# Altium project SFPP.PrjPCB (part 1 of 2)
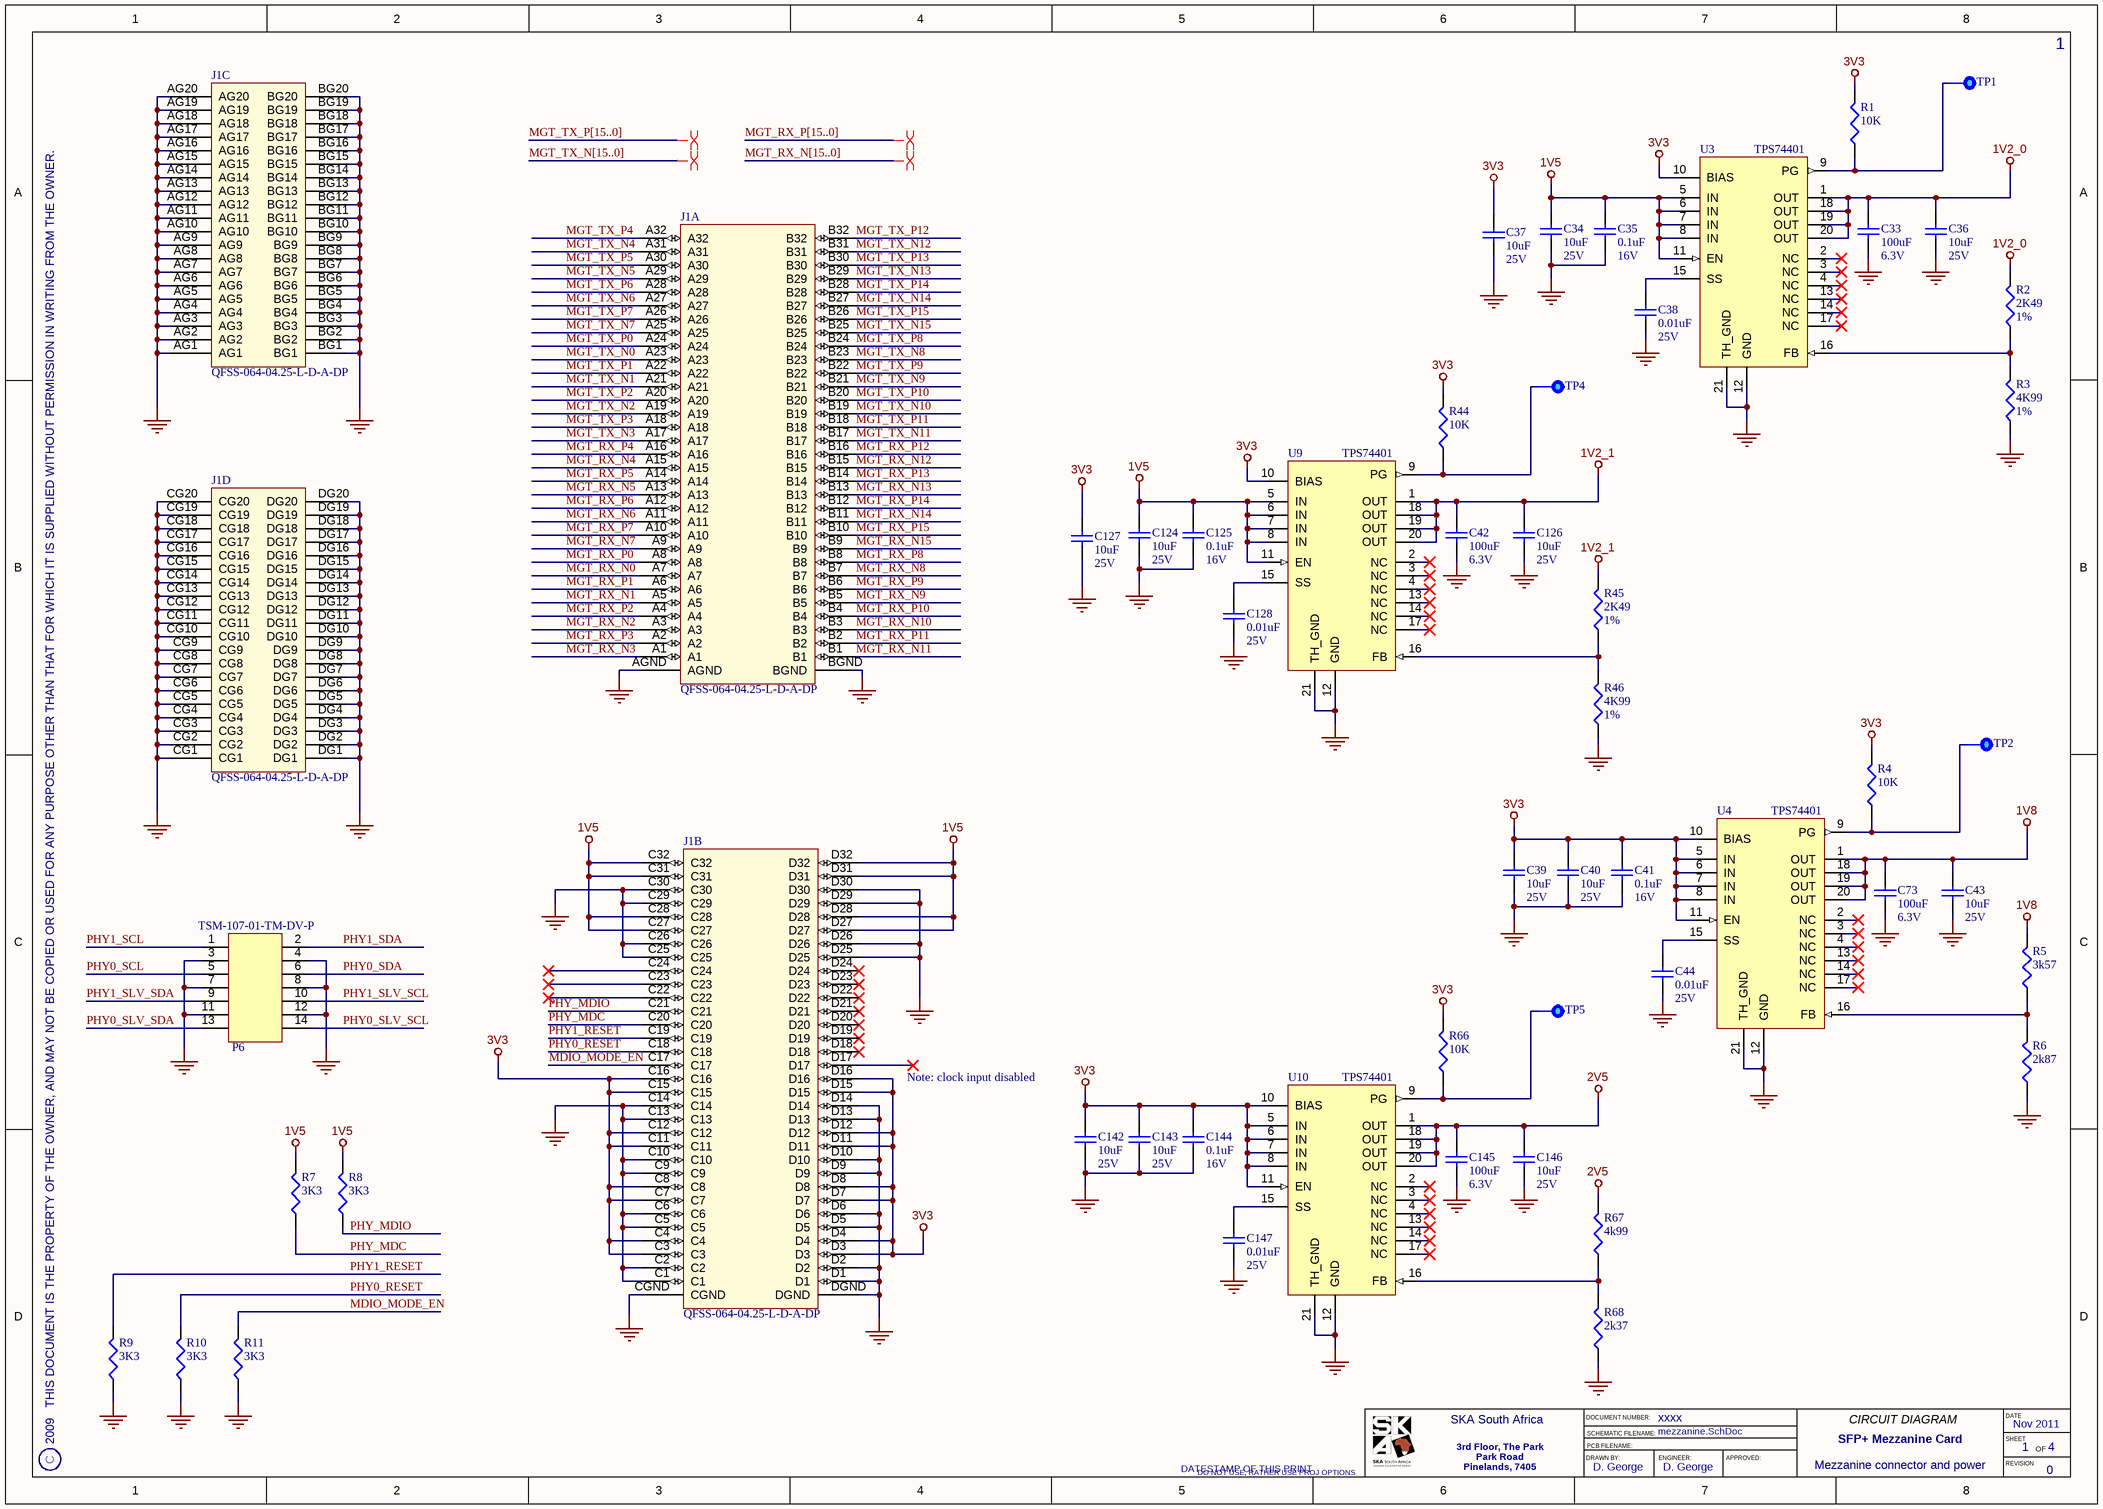
[diagram p0: mezzanine.SchDoc]
COMPANY_ADDRESS_1: 3rd Floor, The Park; COMPANY_ADDRESS_2: Park Road; COMPANY_ADDRESS_3: Pinelands, 7405; COMPANY_NAME1: SKA South Africa; COPYRIGHT_YEAR: 2011; PCB_REVISION: 0; PROJECT_TITLE: SFP+ Mezzanine Card; SCH_TITLE_DATE: Nov 2011; SCH_TITLE_DOCUMENTNUMBER: xxxx; SCH_TITLE_DRAWNBY: D. George; SCH_TITLE_ENGINEER: D. George
4 sheets, 259 parts. Net scope: global (net labels, ports and power ports of the same name join across sheets).
Board file: SFPP.PcbDoc
Sheets:
  mezzanine.SchDoc
  phy0.SchDoc
  phy1.SchDoc
  sfpp_conn.SchDoc

## Sheet mezzanine.SchDoc: Mezzanine connector and power
size A3; Date: DO NOT USE, RATHER USE PROJ OPTIONS; DrawnBy: DO NOT USE, RATHER USE PROJ OPTIONS; Engineer: DO NOT USE, RATHER USE PROJ OPTIONS; Organization: DO NOT USE, RATHER USE PROJ OPTIONS; DocumentNumber: DO NOT USE, RATHER USE PROJ OPTIONS; Revision: DO NOT USE, RATHER USE PROJ OPTIONS; SheetNumber: 1; SheetTotal: 4; SCH_Sheet_Filename: mezzanine.SchDoc; CurrentTime: DO NOT USE, RATHER USE PROJ OPTIONS; Time: DO NOT USE, RATHER USE PROJ OPTIONS; DocumentFullPathAndName: DO NOT USE, RATHER USE PROJ OPTIONS; DocumentName: DO NOT USE, RATHER USE PROJ OPTIONS; ModifiedDate: DO NOT USE, RATHER USE PROJ OPTIONS; ImagePath: DO NOT USE, RATHER USE PROJ OPTIONS

### Parts
C33  Rating: 6.3V  [CAPC3225X270L]  (hidden comment: 100uF)
C34  Rating: 25V  [CAPC3225X200L]  (hidden comment: 10uF)
C35  Rating: 16V  [CAPC1005X60L]  (hidden comment: 0.1uF)
C36  Rating: 25V  [CAPC3225X200L]  (hidden comment: 10uF)
C37  Rating: 25V  [CAPC3225X200L]  (hidden comment: 10uF)
C38  Rating: 25V  [CAPC1005X55L]  (hidden comment: 0.01uF)
C39  Rating: 25V  [CAPC3225X200L]  (hidden comment: 10uF)
C40  Rating: 25V  [CAPC3225X200L]  (hidden comment: 10uF)
C41  Rating: 16V  [CAPC1005X60L]  (hidden comment: 0.1uF)
C42  Rating: 6.3V  [CAPC3225X270L]  (hidden comment: 100uF)
C43  Rating: 25V  [CAPC3225X200L]  (hidden comment: 10uF)
C44  Rating: 25V  [CAPC1005X55L]  (hidden comment: 0.01uF)
C73  Rating: 6.3V  [CAPC3225X270L]  (hidden comment: 100uF)
C124  Rating: 25V  [CAPC3225X200L]  (hidden comment: 10uF)
C125  Rating: 16V  [CAPC1005X60L]  (hidden comment: 0.1uF)
C126  Rating: 25V  [CAPC3225X200L]  (hidden comment: 10uF)
C127  Rating: 25V  [CAPC3225X200L]  (hidden comment: 10uF)
C128  Rating: 25V  [CAPC1005X55L]  (hidden comment: 0.01uF)
C142  Rating: 25V  [CAPC3225X200L]  (hidden comment: 10uF)
C143  Rating: 25V  [CAPC3225X200L]  (hidden comment: 10uF)
C144  Rating: 16V  [CAPC1005X60L]  (hidden comment: 0.1uF)
C145  Rating: 6.3V  [CAPC3225X270L]  (hidden comment: 100uF)
C146  Rating: 25V  [CAPC3225X200L]  (hidden comment: 10uF)
C147  Rating: 25V  [CAPC1005X55L]  (hidden comment: 0.01uF)
J1  QFSS-064-04.25-L-D-A-DP  [SAMTEC_QFSS-064-04.25-L-D-DP-A]  (parts A,B,C,D of 4)
P6  TSM-107-01-TM-DV-P  [SAMTEC_TSM-107-01-TM-DV-P]
R1  10K  [RESC1005X40L]
R2  Tolerance: 1%  [RESC1005X40L]  (hidden comment: 2K49)
R3  Tolerance: 1%  [RESC1005X40L]  (hidden comment: 4K99)
R4  10K  [RESC1005X40L]
R5  3k57  [RESC1005X40L]
R6  2k87  [RESC1005X40L]
R7  3K3  [RESC1005X40L]
R8  3K3  [RESC1005X40L]
R9  3K3  [RESC1005X40L]
R10  3K3  [RESC1005X40L]
R11  3K3  [RESC1005X40L]
R44  10K  [RESC1005X40L]
R45  Tolerance: 1%  [RESC1005X40L]  (hidden comment: 2K49)
R46  Tolerance: 1%  [RESC1005X40L]  (hidden comment: 4K99)
R66  10K  [RESC1005X40L]
R67  value 4k99  [RESC1005X40L]  (hidden comment: 3k57)
R68  value 2k37  [RESC1005X40L]  (hidden comment: 2k87)
TP1  Testpoint  [TP100]  (value not drawn)  (no BOM)
TP2  Testpoint  [TP100]  (value not drawn)  (no BOM)
TP4  Testpoint  [TP100]  (value not drawn)  (no BOM)
TP5  Testpoint  [TP100]  (value not drawn)  (no BOM)
U3  TPS74401  [VQFN20]
U4  TPS74401  [VQFN20]
U9  TPS74401  [VQFN20]
U10  TPS74401  [VQFN20]

### Nets
1V2_0: C33.2 C36.2 R2.2 U3.1(OUT) U3.18(OUT) U3.19(OUT) U3.20(OUT)
1V2_1: C42.2 C126.2 R45.2 U9.1(OUT) U9.18(OUT) U9.19(OUT) U9.20(OUT)
1V5: C34.2 C35.2 C124.2 C125.2 J1.C27 J1.C28 J1.C31 J1.C32 J1.D27 J1.D28 J1.D31 J1.D32 R7.2 R8.2 U3.5(IN) U3.6(IN) U3.7(IN) U3.8(IN) U3.11(EN) U9.5(IN) U9.6(IN) U9.7(IN) U9.8(IN) U9.11(EN)
1V8: C43.2 C73.2 R5.2 U4.1(OUT) U4.18(OUT) U4.19(OUT) U4.20(OUT)
2V5: C145.2 C146.2 R67.2 U10.1(OUT) U10.18(OUT) U10.19(OUT) U10.20(OUT)
3V3: C37.2 C39.2 C40.2 C41.2 C127.2 C142.2 C143.2 C144.2 J1.C3 J1.C4 J1.C7 J1.C8 J1.C11 J1.C12 J1.C15 J1.C16 J1.D3 J1.D4 J1.D7 J1.D8 J1.D11 J1.D12 J1.D15 J1.D16 R1.2 R4.2 R44.2 R66.2 U3.10(BIAS) U4.5(IN) U4.6(IN) U4.7(IN) U4.8(IN) U4.10(BIAS) U4.11(EN) U9.10(BIAS) U10.5(IN) U10.6(IN) U10.7(IN) U10.8(IN) U10.10(BIAS) U10.11(EN)
GND: C33.1 C34.1 C35.1 C36.1 C37.1 C38.1 C39.1 C40.1 C41.1 C42.1 C43.1 C44.1 C73.1 C124.1 C125.1 C126.1 C127.1 C128.1 C142.1 C143.1 C144.1 C145.1 C146.1 C147.1 J1.AG1 J1.AG2 J1.AG3 J1.AG4 J1.AG5 J1.AG6 J1.AG7 J1.AG8 J1.AG9 J1.AG10 J1.AG11 J1.AG12 J1.AG13 J1.AG14 J1.AG15 J1.AG16 J1.AG17 J1.AG18 J1.AG19 J1.AG20 J1.AGND J1.BG1 J1.BG2 J1.BG3 J1.BG4 J1.BG5 J1.BG6 J1.BG7 J1.BG8 J1.BG9 J1.BG10 J1.BG11 J1.BG12 J1.BG13 J1.BG14 J1.BG15 J1.BG16 J1.BG17 J1.BG18 J1.BG19 J1.BG20 J1.BGND J1.C1 J1.C2 J1.C5 J1.C6 J1.C9 J1.C10 J1.C13 J1.C14 J1.C25 J1.C26 J1.C29 J1.C30 J1.CG1 J1.CG2 J1.CG3 J1.CG4 J1.CG5 J1.CG6 J1.CG7 J1.CG8 J1.CG9 J1.CG10 J1.CG11 J1.CG12 J1.CG13 J1.CG14 J1.CG15 J1.CG16 J1.CG17 J1.CG18 J1.CG19 J1.CG20 J1.CGND J1.D1 J1.D2 J1.D5 J1.D6 J1.D9 J1.D10 J1.D13 J1.D14 J1.D25 J1.D26 J1.D29 J1.D30 J1.DG1 J1.DG2 J1.DG3 J1.DG4 J1.DG5 J1.DG6 J1.DG7 J1.DG8 J1.DG9 J1.DG10 J1.DG11 J1.DG12 J1.DG13 J1.DG14 J1.DG15 J1.DG16 J1.DG17 J1.DG18 J1.DG19 J1.DG20 J1.DGND P6.3 P6.4 P6.7 P6.8 P6.11 P6.12 R3.1 R6.1 R9.1 R10.1 R11.1 R46.1 R68.1 U3.12(GND) U3.21(TH_GND) U4.12(GND) U4.21(TH_GND) U9.12(GND) U9.21(TH_GND) U10.12(GND) U10.21(TH_GND)
MDIO_MODE_EN: J1.C17 R11.2
MGT_RX_N0: J1.A7
MGT_RX_N1: J1.A5
MGT_RX_N2: J1.A3
MGT_RX_N3: J1.A1
MGT_RX_N4: J1.A15
MGT_RX_N5: J1.A13
MGT_RX_N6: J1.A11
MGT_RX_N7: J1.A9
MGT_RX_N8: J1.B7
MGT_RX_N9: J1.B5
MGT_RX_N10: J1.B3
MGT_RX_N11: J1.B1
MGT_RX_N12: J1.B15
MGT_RX_N13: J1.B13
MGT_RX_N14: J1.B11
MGT_RX_N15: J1.B9
MGT_RX_P0: J1.A8
MGT_RX_P1: J1.A6
MGT_RX_P2: J1.A4
MGT_RX_P3: J1.A2
MGT_RX_P4: J1.A16
MGT_RX_P5: J1.A14
MGT_RX_P6: J1.A12
MGT_RX_P7: J1.A10
MGT_RX_P8: J1.B8
MGT_RX_P9: J1.B6
MGT_RX_P10: J1.B4
MGT_RX_P11: J1.B2
MGT_RX_P12: J1.B16
MGT_RX_P13: J1.B14
MGT_RX_P14: J1.B12
MGT_RX_P15: J1.B10
MGT_TX_N0: J1.A23
MGT_TX_N1: J1.A21
MGT_TX_N2: J1.A19
MGT_TX_N3: J1.A17
MGT_TX_N4: J1.A31
MGT_TX_N5: J1.A29
MGT_TX_N6: J1.A27
MGT_TX_N7: J1.A25
MGT_TX_N8: J1.B23
MGT_TX_N9: J1.B21
MGT_TX_N10: J1.B19
MGT_TX_N11: J1.B17
MGT_TX_N12: J1.B31
MGT_TX_N13: J1.B29
MGT_TX_N14: J1.B27
MGT_TX_N15: J1.B25
MGT_TX_P0: J1.A24
MGT_TX_P1: J1.A22
MGT_TX_P2: J1.A20
MGT_TX_P3: J1.A18
MGT_TX_P4: J1.A32
MGT_TX_P5: J1.A30
MGT_TX_P6: J1.A28
MGT_TX_P7: J1.A26
MGT_TX_P8: J1.B24
MGT_TX_P9: J1.B22
MGT_TX_P10: J1.B20
MGT_TX_P11: J1.B18
MGT_TX_P12: J1.B32
MGT_TX_P13: J1.B30
MGT_TX_P14: J1.B28
MGT_TX_P15: J1.B26
PHY0_RESET: J1.C18 R10.2
PHY0_SCL: P6.5
PHY0_SDA: P6.6
PHY0_SLV_SCL: P6.14
PHY0_SLV_SDA: P6.13
PHY1_RESET: J1.C19 R9.2
PHY1_SCL: P6.1
PHY1_SDA: P6.2
PHY1_SLV_SCL: P6.10
PHY1_SLV_SDA: P6.9
PHY_MDC: J1.C20 R7.1
PHY_MDIO: J1.C21 R8.1
NetC38_2: C38.2 U3.15(SS)
NetC44_2: C44.2 U4.15(SS)
NetC128_2: C128.2 U9.15(SS)
NetC147_2: C147.2 U10.15(SS)
NetR1_1: R1.1 TP1.1 U3.9(PG)
NetR2_1: R2.1 R3.2 U3.16(FB)
NetR4_1: R4.1 TP2.1 U4.9(PG)
NetR5_1: R5.1 R6.2 U4.16(FB)
NetR44_1: R44.1 TP4.1 U9.9(PG)
NetR45_1: R45.1 R46.2 U9.16(FB)
NetR66_1: R66.1 TP5.1 U10.9(PG)
NetR67_1: R67.1 R68.2 U10.16(FB)

Not connected (* = marked no-connect by the designer): J1 C22* C23* C24* D17* D18* D19* D20* D21* D22* D23* D24*; U3 2(NC)* 3(NC)* 4(NC)* 13(NC)* 14(NC)* 17(NC)*; U4 2(NC)* 3(NC)* 4(NC)* 13(NC)* 14(NC)* 17(NC)*; U9 2(NC)* 3(NC)* 4(NC)* 13(NC)* 14(NC)* 17(NC)*; U10 2(NC)* 3(NC)* 4(NC)* 13(NC)* 14(NC)* 17(NC)*

### Buses and harness runs
bus MGT_RX_N[15..0]
bus MGT_RX_P[15..0]
bus MGT_TX_N[15..0]
bus MGT_TX_P[15..0]

### Layout directives
differential pair: (no net found under the mark)

### Notes on the sheet
- (near C142) Note: clock input disabled
- 2009   THIS DOCUMENT IS THE PROPERTY OF THE OWNER, AND MAY NOT BE COPIED OR USED FOR ANY PURPOSE OTHER THAN THAT FOR WHICH IT IS SUPPLIED WITHOUT PERMISSION IN WRITING FROM THE OWNER.
- C
- DATESTAMP OF THIS PRINT
- DRAWN BY:
- DOCUMENT NUMBER:
- SCHEMATIC FILENAME:
- PCB FILENAME:
- ENGINEER:
- APPROVED:
- CIRCUIT DIAGRAM
- DATE
- SHEET
- REVISION
- OF

### Library data of the parts
C33 C42 C73 C145 = CAP-CER-13: 100uF, 1210, Ceramic Capacitor; Manufacturer: TDK; PartNum: C3225X5R0J107M; Tolerance: 20%; Dielectric: X5R; POD number: CAP-CER-13; Value: 100uF; RoHS: Y; Sort Value: 100; Category: Capacitors; Subcategory: Ceramic
C34 C36 C37 C39 C40 C43 C124 C126 C127 C142 C143 C146 = CAP-CER-5: 10uF, Ceramic Capacitor; Manufacturer: MURATA; PartNum: GRM32DR61E106KA12L; Tolerance: 10%; Dielectric: X5R; POD number: CAP-CER-5; Value: 10uF; RoHS: Y; Sort Value: 100; Category: Capacitors; Subcategory: Ceramic
C35 C41 C125 C144 = CAP-CER-1: 0.1uF, Ceramic Capacitor; Manufacturer: VENKEL; PartNum: C0402X7R160-104KN; Tolerance: 10%; Dielectric: X7R; POD number: CAP-CER-1; Value: 0.1uF; RoHS: Y; Sort Value: 0.1; Category: Capacitors; Subcategory: Ceramic
C38 C44 C128 C147 = CAP-CER-6: 0.01uF, Ceramic Capacitor; Manufacturer: MURATA; PartNum: GRM155R71E103KA01D; Tolerance: 10%; Dielectric: X7R; POD number: CAP-CER-6; Value: 0.01uF; RoHS: Y; Sort Value: 0.01; Category: Capacitors; Subcategory: Ceramic
J1 = CONN-PCB-19: Shielded, 64-Differential Pair, Rugged High-Speed Terminal Strip, 0.635mm Pitch; Manufacturer: SAMTEC; POD number: CONN-PCB-19; PartNum: QFSS-064-04.25-L-D-A-DP; RoHS: Y; Category: CONN; Subcategory: PCB
P6 = CONN-PCB-16: 2x7, 2.54 mm Pitch, Male Header; Manufacturer: SAMTEC; POD number: CONN-PCB-16; PartNum: TSM-107-01-TM-DV-P; RoHS: Y; Category: CONN; Subcategory: PCB
R1 R4 R44 R66 = RES-TF-5: 10K, 1.1mm x 0.5mm, Thick Film Resistor; Manufacturer: ROYALOHM; PartNum: 0402WGJ0103T1E; Tolerance: 5%; Rating: 0.0625W; POD number: RES-TF-5; Value: 10K; Sort Value: 10000; Category: Resistors; Subcategory: ThickFilm; HelpURL: *.pdf
R2 R45 = RES-TF-36: 2K49, 1.1mm x 0.5mm, Thick Film Resistor; Manufacturer: ROYALOHM; PartNum: 0402WGF2K49T1E; Rating: 0.0625W; POD number: RES-TF-36; Value: 2K49; Sort Value: 2490; Category: Resistors; Subcategory: ThickFilm; HelpURL: *.pdf
R3 R46 = RES-TF-13: 4K99, 1.1mm x 0.5mm, Thick Film Resistor; Manufacturer: ROYALOHM; PartNum: 0402WGF4991T1E; Rating: 0.0625W; POD number: RES-TF-13; Value: 4K99; Sort Value: 4990; Category: Resistors; Subcategory: ThickFilm; HelpURL: *.pdf
R5 R67 = RES-TF-45: 3K57, 1.1mm x 0.5mm, Thick Film Resistor; Manufacturer: STACKPOLE; PartNum: RMC0402FT3K57; Tolerance: 1%; Rating: 0.0625W; POD number: RES-TF-45; RoHS: Y; Sort Value: 3570; Category: Resistors; Subcategory: ThickFilm; HelpURL: http://www.royalohm.com/pdf/general.pdf
  R5: Value: 3k57
R6 R68 = RES-TF-46: 2K87, 1.1mm x 0.5mm, Thick Film Resistor; Manufacturer: STACKPOLE; PartNum: RMC0402FT2K87; Tolerance: 1%; Rating: 0.0625W; POD number: RES-TF-46; RoHS: Y; Sort Value: 2870; Category: Resistors; Subcategory: ThickFilm; HelpURL: http://www.royalohm.com/pdf/general.pdf
  R6: Value: 2k87
R7-R11 = RES-TF-7: 3K3, 1.1mm x 0.5mm, Thick Film Resistor; Manufacturer: ROYALOHM; PartNum: 0402WGJ0332T1E; Tolerance: 5%; Rating: 0.0625W; POD number: RES-TF-7; Value: 3K3; Sort Value: 3300; Category: Resistors; Subcategory: ThickFilm; HelpURL: http://www.royalohm.com/pdf/general.pdf
TP1 TP2 TP4 TP5 = ELMECH-TP-0: 1mm Diameter, through-hole, Circular Test-point; POD number: ELMECH-TP-0; RoHS: Y; Category: ELMECH; Subcategory: Test Points
U3 U4 U9 U10 = IC-REG-5: 3.0A Ultra-LDO with Programmable Soft-Start; Manufacturer: Texas Instruments; POD number: IC-REG-5; PartNum: TPS74401; RoHS: Y; Category: IC; Subcategory: Regulators

## Sheet phy0.SchDoc: SFP+ PHY 0
size A3; Date: DO NOT USE, RATHER USE PROJ OPTIONS; DrawnBy: DO NOT USE, RATHER USE PROJ OPTIONS; Engineer: DO NOT USE, RATHER USE PROJ OPTIONS; Organization: DO NOT USE, RATHER USE PROJ OPTIONS; DocumentNumber: DO NOT USE, RATHER USE PROJ OPTIONS; Revision: DO NOT USE, RATHER USE PROJ OPTIONS; SheetNumber: 2; SheetTotal: 4; SCH_Sheet_Filename: phy0.SchDoc; CurrentTime: DO NOT USE, RATHER USE PROJ OPTIONS; Time: DO NOT USE, RATHER USE PROJ OPTIONS; DocumentFullPathAndName: DO NOT USE, RATHER USE PROJ OPTIONS; DocumentName: DO NOT USE, RATHER USE PROJ OPTIONS; ModifiedDate: DO NOT USE, RATHER USE PROJ OPTIONS; ImagePath: DO NOT USE, RATHER USE PROJ OPTIONS
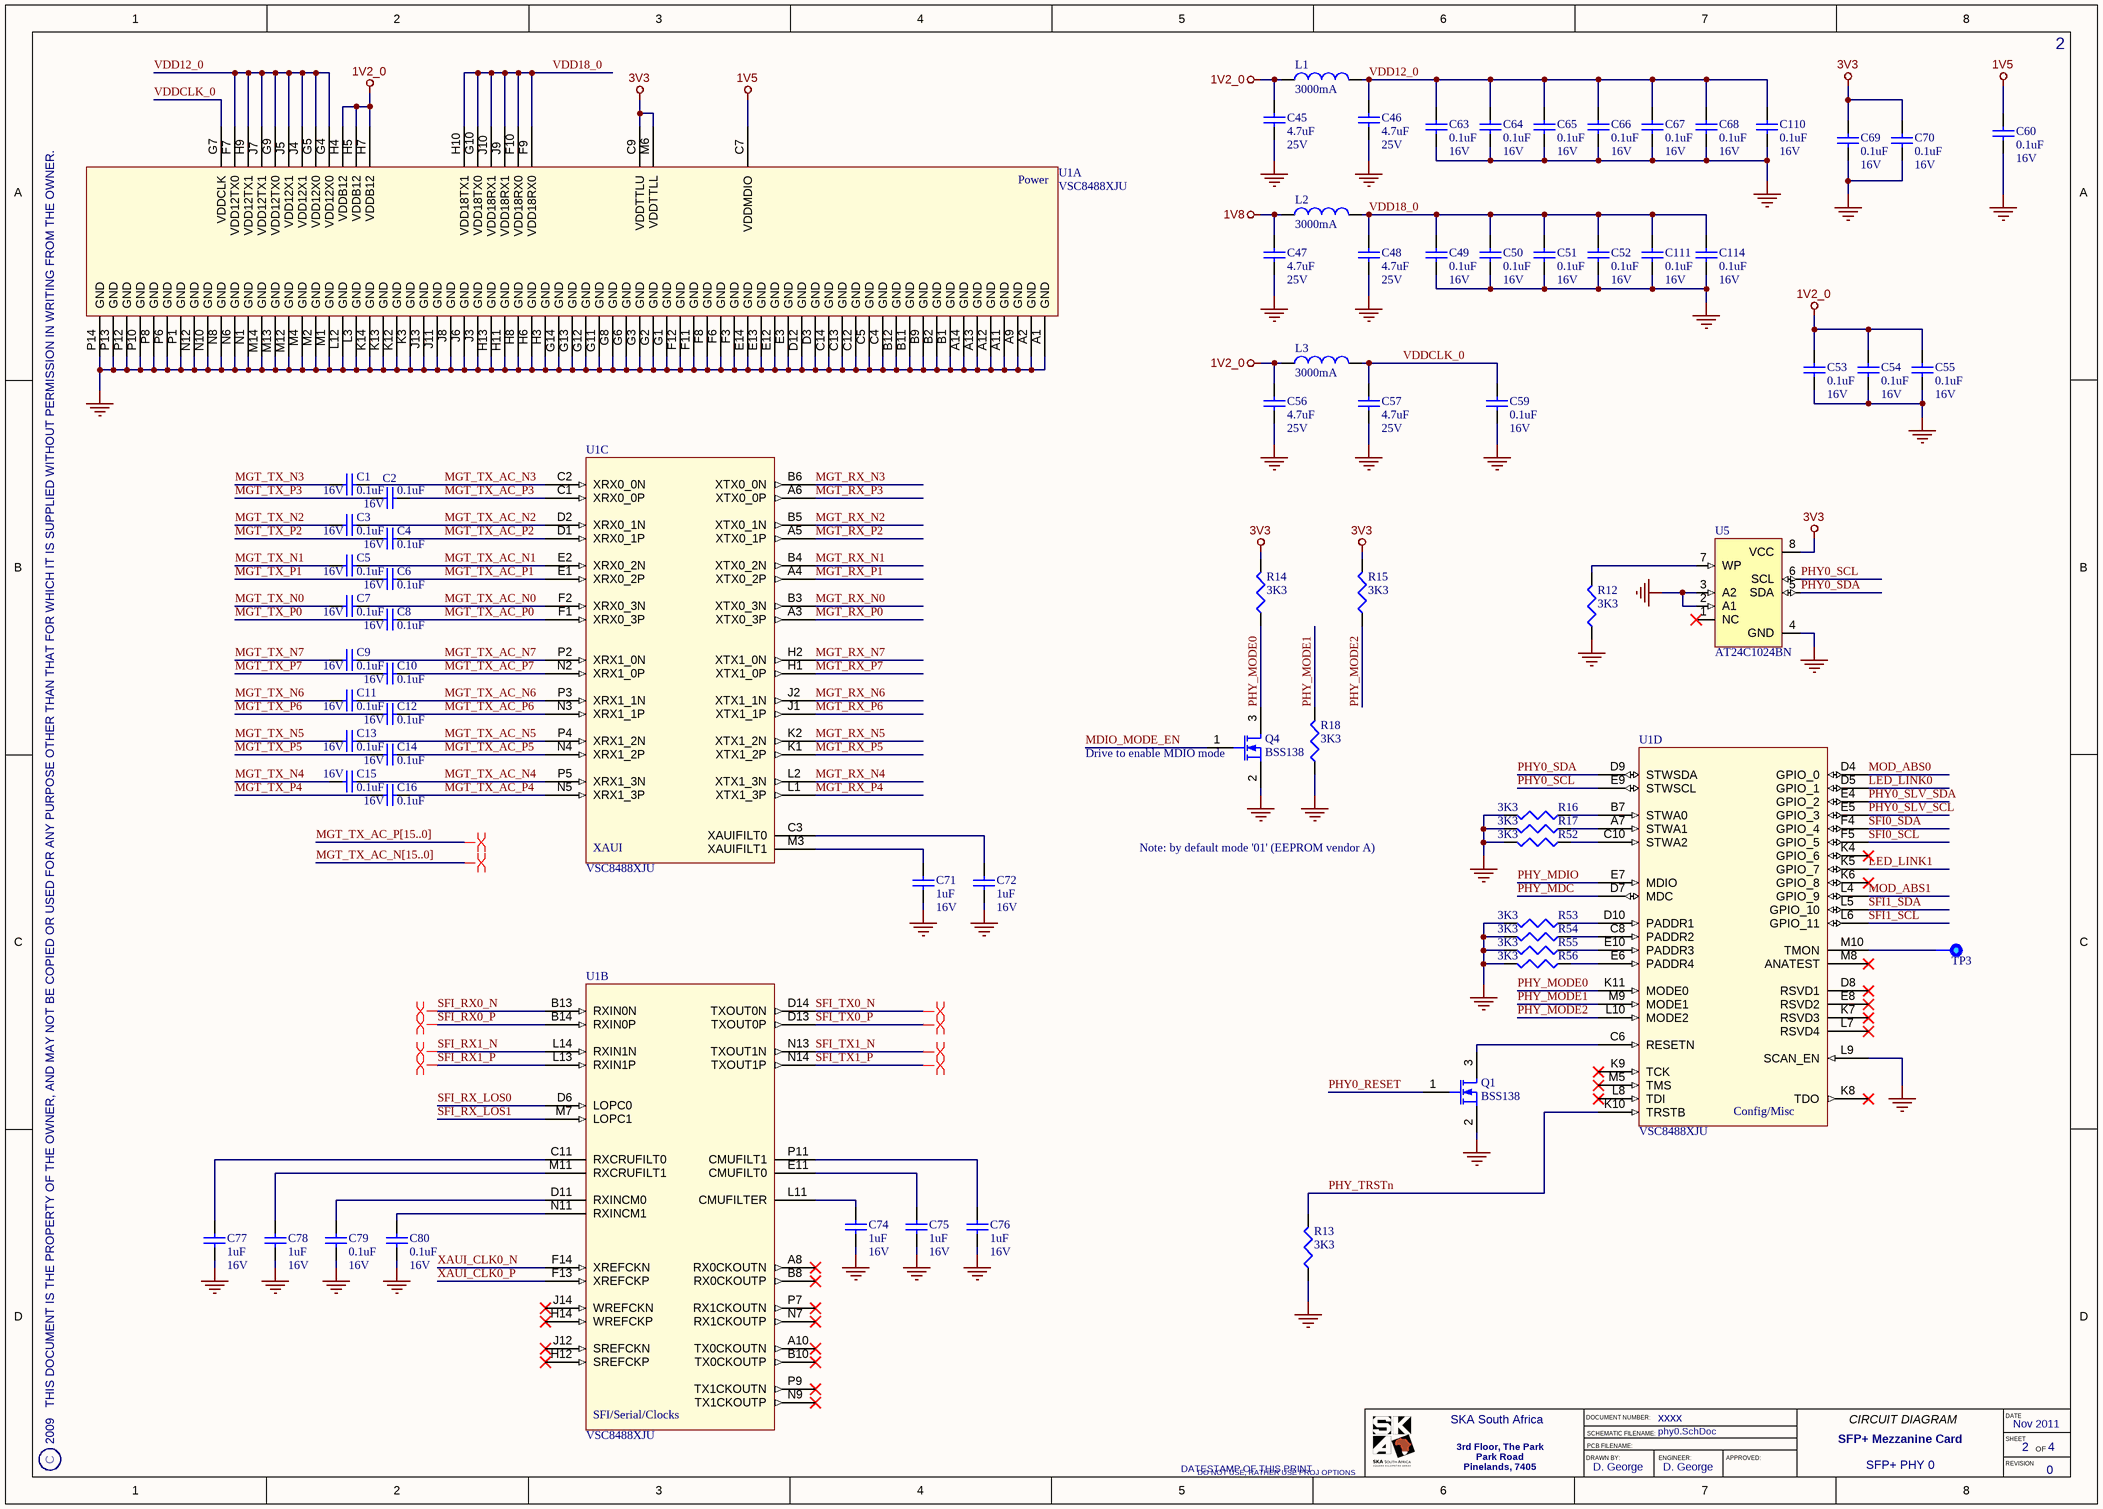
[diagram p1: phy0.SchDoc]

### Parts
C1  Rating: 16V  [CAPC1005X60L]  (hidden comment: 0.1uF)
C2  Rating: 16V  [CAPC1005X60L]  (hidden comment: 0.1uF)
C3  Rating: 16V  [CAPC1005X60L]  (hidden comment: 0.1uF)
C4  Rating: 16V  [CAPC1005X60L]  (hidden comment: 0.1uF)
C5  Rating: 16V  [CAPC1005X60L]  (hidden comment: 0.1uF)
C6  Rating: 16V  [CAPC1005X60L]  (hidden comment: 0.1uF)
C7  Rating: 16V  [CAPC1005X60L]  (hidden comment: 0.1uF)
C8  Rating: 16V  [CAPC1005X60L]  (hidden comment: 0.1uF)
C9  Rating: 16V  [CAPC1005X60L]  (hidden comment: 0.1uF)
C10  Rating: 16V  [CAPC1005X60L]  (hidden comment: 0.1uF)
C11  Rating: 16V  [CAPC1005X60L]  (hidden comment: 0.1uF)
C12  Rating: 16V  [CAPC1005X60L]  (hidden comment: 0.1uF)
C13  Rating: 16V  [CAPC1005X60L]  (hidden comment: 0.1uF)
C14  Rating: 16V  [CAPC1005X60L]  (hidden comment: 0.1uF)
C15  Rating: 16V  [CAPC1005X60L]  (hidden comment: 0.1uF)
C16  Rating: 16V  [CAPC1005X60L]  (hidden comment: 0.1uF)
C45  Rating: 25V  [CAPC2012X127L]  (hidden comment: 4.7uF)
C46  Rating: 25V  [CAPC2012X127L]  (hidden comment: 4.7uF)
C47  Rating: 25V  [CAPC2012X127L]  (hidden comment: 4.7uF)
C48  Rating: 25V  [CAPC2012X127L]  (hidden comment: 4.7uF)
C49  Rating: 16V  [CAPC1005X60L]  (hidden comment: 0.1uF)
C50  Rating: 16V  [CAPC1005X60L]  (hidden comment: 0.1uF)
C51  Rating: 16V  [CAPC1005X60L]  (hidden comment: 0.1uF)
C52  Rating: 16V  [CAPC1005X60L]  (hidden comment: 0.1uF)
C53  Rating: 16V  [CAPC1005X60L]  (hidden comment: 0.1uF)
C54  Rating: 16V  [CAPC1005X60L]  (hidden comment: 0.1uF)
C55  Rating: 16V  [CAPC1005X60L]  (hidden comment: 0.1uF)
C56  Rating: 25V  [CAPC2012X127L]  (hidden comment: 4.7uF)
C57  Rating: 25V  [CAPC2012X127L]  (hidden comment: 4.7uF)
C59  Rating: 16V  [CAPC1005X60L]  (hidden comment: 0.1uF)
C60  Rating: 16V  [CAPC1005X60L]  (hidden comment: 0.1uF)
C63  Rating: 16V  [CAPC1005X60L]  (hidden comment: 0.1uF)
C64  Rating: 16V  [CAPC1005X60L]  (hidden comment: 0.1uF)
C65  Rating: 16V  [CAPC1005X60L]  (hidden comment: 0.1uF)
C66  Rating: 16V  [CAPC1005X60L]  (hidden comment: 0.1uF)
C67  Rating: 16V  [CAPC1005X60L]  (hidden comment: 0.1uF)
C68  Rating: 16V  [CAPC1005X60L]  (hidden comment: 0.1uF)
C69  Rating: 16V  [CAPC1005X60L]  (hidden comment: 0.1uF)
C70  Rating: 16V  [CAPC1005X60L]  (hidden comment: 0.1uF)
C71  Rating: 16V  [CAPC2012X127L]  (hidden comment: 1uF)
C72  Rating: 16V  [CAPC2012X127L]  (hidden comment: 1uF)
C74  Rating: 16V  [CAPC2012X127L]  (hidden comment: 1uF)
C75  Rating: 16V  [CAPC2012X127L]  (hidden comment: 1uF)
C76  Rating: 16V  [CAPC2012X127L]  (hidden comment: 1uF)
C77  Rating: 16V  [CAPC2012X127L]  (hidden comment: 1uF)
C78  Rating: 16V  [CAPC2012X127L]  (hidden comment: 1uF)
C79  Rating: 16V  [CAPC1005X60L]  (hidden comment: 0.1uF)
C80  Rating: 16V  [CAPC1005X60L]  (hidden comment: 0.1uF)
C110  Rating: 16V  [CAPC1005X60L]  (hidden comment: 0.1uF)
C111  Rating: 16V  [CAPC1005X60L]  (hidden comment: 0.1uF)
C114  Rating: 16V  [CAPC1005X60L]  (hidden comment: 0.1uF)
L1  Rating: 3000mA  [INDC3216X130L]  (hidden comment: 120R)
L2  Rating: 3000mA  [INDC3216X130L]  (hidden comment: 120R)
L3  Rating: 3000mA  [INDC3216X130L]  (hidden comment: 120R)
Q1  BSS138  [SOT95P245X110-3N]
Q4  BSS138  [SOT95P245X110-3N]
R12  3K3  [RESC1005X40L]
R13  3K3  [RESC1005X40L]
R14  3K3  [RESC1005X40L]
R15  3K3  [RESC1005X40L]
R16  3K3  [RESC1005X40L]
R17  3K3  [RESC1005X40L]
R18  3K3  [RESC1005X40L]
R52  3K3  [RESC1005X40L]
R53  3K3  [RESC1005X40L]
R54  3K3  [RESC1005X40L]
R55  3K3  [RESC1005X40L]
R56  3K3  [RESC1005X40L]
TP3  Testpoint  [TP100]  (value not drawn)  (no BOM)
U1  VSC8488XJU  [BGA196C100P14X14_1500x1500x140]  (parts A,B,C,D of 4)
U5  AT24C1024BN  [SOIC150-8_N]

### Nets
1V2_0: C45.2 C53.2 C54.2 C55.2 C56.2 L1.1 L3.1 U1.H4(VDDB12) U1.H5(VDDB12) U1.H7(VDDB12)
1V5: C60.2 U1.C7(VDDMDIO)
1V8: C47.2 L2.1
3V3: C69.2 C70.2 R14.2 R15.2 U1.C9(VDDTTLU) U1.M6(VDDTTLL) U5.8(VCC)
GND: C45.1 C46.1 C47.1 C48.1 C49.1 C50.1 C51.1 C52.1 C53.1 C54.1 C55.1 C56.1 C57.1 C59.1 C60.1 C63.1 C64.1 C65.1 C66.1 C67.1 C68.1 C69.1 C70.1 C71.2 C72.2 C74.2 C75.2 C76.2 C77.2 C78.2 C79.1 C80.1 C110.1 C111.1 C114.1 Q1.2(S) Q4.2(S) R12.1 R13.1 R16.2 R17.2 R18.1 R52.2 R53.2 R54.2 R55.2 R56.2 U1.A1(GND) U1.A2(GND) U1.A9(GND) U1.A11(GND) U1.A12(GND) U1.A13(GND) U1.A14(GND) U1.B1(GND) U1.B2(GND) U1.B9(GND) U1.B11(GND) U1.B12(GND) U1.C4(GND) U1.C5(GND) U1.C12(GND) U1.C13(GND) U1.C14(GND) U1.D3(GND) U1.D12(GND) U1.E3(GND) U1.E12(GND) U1.E13(GND) U1.E14(GND) U1.F3(GND) U1.F6(GND) U1.F8(GND) U1.F11(GND) U1.F12(GND) U1.G1(GND) U1.G2(GND) U1.G3(GND) U1.G6(GND) U1.G8(GND) U1.G11(GND) U1.G12(GND) U1.G13(GND) U1.G14(GND) U1.H3(GND) U1.H6(GND) U1.H8(GND) U1.H11(GND) U1.H13(GND) U1.J3(GND) U1.J6(GND) U1.J8(GND) U1.J11(GND) U1.J13(GND) U1.K3(GND) U1.K12(GND) U1.K13(GND) U1.K14(GND) U1.L3(GND) U1.L9(SCAN_EN) U1.L12(GND) U1.M1(GND) U1.M2(GND) U1.M4(GND) U1.M12(GND) U1.M13(GND) U1.M14(GND) U1.N1(GND) U1.N6(GND) U1.N8(GND) U1.N10(GND) U1.N12(GND) U1.P1(GND) U1.P6(GND) U1.P8(GND) U1.P10(GND) U1.P12(GND) U1.P13(GND) U1.P14(GND) U5.2(A1) U5.3(A2) U5.4(GND)
LED_LINK0: U1.D5(GPIO_1)
LED_LINK1: U1.K5(GPIO_7)
MDIO_MODE_EN: Q4.1(G)
MGT_RX_N0: U1.B3(XTX0_3N)
MGT_RX_N1: U1.B4(XTX0_2N)
MGT_RX_N2: U1.B5(XTX0_1N)
MGT_RX_N3: U1.B6(XTX0_0N)
MGT_RX_N4: U1.L2(XTX1_3N)
MGT_RX_N5: U1.K2(XTX1_2N)
MGT_RX_N6: U1.J2(XTX1_1N)
MGT_RX_N7: U1.H2(XTX1_0N)
MGT_RX_P0: U1.A3(XTX0_3P)
MGT_RX_P1: U1.A4(XTX0_2P)
MGT_RX_P2: U1.A5(XTX0_1P)
MGT_RX_P3: U1.A6(XTX0_0P)
MGT_RX_P4: U1.L1(XTX1_3P)
MGT_RX_P5: U1.K1(XTX1_2P)
MGT_RX_P6: U1.J1(XTX1_1P)
MGT_RX_P7: U1.H1(XTX1_0P)
MGT_TX_AC_N0: C7.1 U1.F2(XRX0_3N)
MGT_TX_AC_N1: C5.1 U1.E2(XRX0_2N)
MGT_TX_AC_N2: C3.1 U1.D2(XRX0_1N)
MGT_TX_AC_N3: C1.1 U1.C2(XRX0_0N)
MGT_TX_AC_N4: C15.1 U1.P5(XRX1_3N)
MGT_TX_AC_N5: C13.1 U1.P4(XRX1_2N)
MGT_TX_AC_N6: C11.1 U1.P3(XRX1_1N)
MGT_TX_AC_N7: C9.1 U1.P2(XRX1_0N)
MGT_TX_AC_P0: C8.1 U1.F1(XRX0_3P)
MGT_TX_AC_P1: C6.1 U1.E1(XRX0_2P)
MGT_TX_AC_P2: C4.1 U1.D1(XRX0_1P)
MGT_TX_AC_P3: C2.1 U1.C1(XRX0_0P)
MGT_TX_AC_P4: C16.1 U1.N5(XRX1_3P)
MGT_TX_AC_P5: C14.1 U1.N4(XRX1_2P)
MGT_TX_AC_P6: C12.1 U1.N3(XRX1_1P)
MGT_TX_AC_P7: C10.1 U1.N2(XRX1_0P)
MGT_TX_N0: C7.2
MGT_TX_N1: C5.2
MGT_TX_N2: C3.2
MGT_TX_N3: C1.2
MGT_TX_N4: C15.2
MGT_TX_N5: C13.2
MGT_TX_N6: C11.2
MGT_TX_N7: C9.2
MGT_TX_P0: C8.2
MGT_TX_P1: C6.2
MGT_TX_P2: C4.2
MGT_TX_P3: C2.2
MGT_TX_P4: C16.2
MGT_TX_P5: C14.2
MGT_TX_P6: C12.2
MGT_TX_P7: C10.2
MOD_ABS0: U1.D4(GPIO_0)
MOD_ABS1: U1.L4(GPIO_9)
PHY0_RESET: Q1.1(G)
PHY0_SCL: U1.E9(STWSCL) U5.6(SCL)
PHY0_SDA: U1.D9(STWSDA) U5.5(SDA)
PHY0_SLV_SCL: U1.E5(GPIO_3)
PHY0_SLV_SDA: U1.E4(GPIO_2)
PHY_MDC: U1.D7(MDC)
PHY_MDIO: U1.E7(MDIO)
PHY_MODE0: Q4.3(D) R14.1 U1.K11(MODE0)
PHY_MODE1: R18.2 U1.M9(MODE1)
PHY_MODE2: R15.1 U1.L10(MODE2)
PHY_TRSTn: R13.2 U1.K10(TRSTB)
SFI0_SCL: U1.F5(GPIO_5)
SFI0_SDA: U1.F4(GPIO_4)
SFI1_SCL: U1.L6(GPIO_11)
SFI1_SDA: U1.L5(GPIO_10)
SFI_RX0_N: U1.B13(RXIN0N)
SFI_RX0_P: U1.B14(RXIN0P)
SFI_RX1_N: U1.L14(RXIN1N)
SFI_RX1_P: U1.L13(RXIN1P)
SFI_RX_LOS0: U1.D6(LOPC0)
SFI_RX_LOS1: U1.M7(LOPC1)
SFI_TX0_N: U1.D14(TXOUT0N)
SFI_TX0_P: U1.D13(TXOUT0P)
SFI_TX1_N: U1.N13(TXOUT1N)
SFI_TX1_P: U1.N14(TXOUT1P)
VDD12_0: C46.2 C63.2 C64.2 C65.2 C66.2 C67.2 C68.2 C110.2 L1.2 U1.F7(VDD12TX0) U1.G4(VDD12X0) U1.G5(VDD12X0) U1.G9(VDD12TX0) U1.H9(VDD12TX1) U1.J4(VDD12X1) U1.J5(VDD12X1) U1.J7(VDD12TX1)
VDD18_0: C48.2 C49.2 C50.2 C51.2 C52.2 C111.2 C114.2 L2.2 U1.F9(VDD18RX0) U1.F10(VDD18RX0) U1.G10(VDD18TX0) U1.H10(VDD18TX1) U1.J9(VDD18RX1) U1.J10(VDD18RX1)
VDDCLK_0: C57.2 C59.2 L3.2 U1.G7(VDDCLK)
XAUI_CLK0_N: U1.F14(XREFCKN)
XAUI_CLK0_P: U1.F13(XREFCKP)
NetC71_1: C71.1 U1.M3(XAUIFILT1)
NetC72_1: C72.1 U1.C3(XAUIFILT0)
NetC74_1: C74.1 U1.L11(CMUFILTER)
NetC75_1: C75.1 U1.E11(CMUFILT0)
NetC76_1: C76.1 U1.P11(CMUFILT1)
NetC77_1: C77.1 U1.C11(RXCRUFILT0)
NetC78_1: C78.1 U1.M11(RXCRUFILT1)
NetC79_2: C79.2 U1.D11(RXINCM0)
NetC80_2: C80.2 U1.N11(RXINCM1)
NetQ1_3: Q1.3(D) U1.C6(RESETN)
NetR12_2: R12.2 U5.7(WP)
NetR16_1: R16.1 U1.B7(STWA0)
NetR17_1: R17.1 U1.A7(STWA1)
NetR52_1: R52.1 U1.C10(STWA2)
NetR53_1: R53.1 U1.D10(PADDR1)
NetR54_1: R54.1 U1.C8(PADDR2)
NetR55_1: R55.1 U1.E10(PADDR3)
NetR56_1: R56.1 U1.E6(PADDR4)
NetTP3_1: TP3.1 U1.M10(TMON)

Not connected (* = marked no-connect by the designer): U1 A8(RX0CKOUTN)* A10(TX0CKOUTN)* B8(RX0CKOUTP)* B10(TX0CKOUTP)* D8(RSVD1)* E8(RSVD2)* H12(SREFCKP)* H14(WREFCKP)* J12(SREFCKN)* J14(WREFCKN)* K4(GPIO_6)* K6(GPIO_8)* K7(RSVD3)* K8(TDO)* K9(TCK)* L7(RSVD4)* L8(TDI)* M5(TMS)* M8(ANATEST)* N7(RX1CKOUTP)* N9(TX1CKOUTP)* P7(RX1CKOUTN)* P9(TX1CKOUTN)*; U5 1(NC)*

### Buses and harness runs
bus MGT_TX_AC_N[15..0]
bus MGT_TX_AC_P[15..0]

### Layout directives
differential pair: (no net found under the mark), SFI_RX0_N, SFI_RX0_P, SFI_RX1_N, SFI_RX1_P, SFI_TX0_N, SFI_TX0_P, SFI_TX1_N, SFI_TX1_P

### Notes on the sheet
- (near Q4) Drive to enable MDIO mode
- Note: by default mode '01' (EEPROM vendor A)
- 2009   THIS DOCUMENT IS THE PROPERTY OF THE OWNER, AND MAY NOT BE COPIED OR USED FOR ANY PURPOSE OTHER THAN THAT FOR WHICH IT IS SUPPLIED WITHOUT PERMISSION IN WRITING FROM THE OWNER.
- C
- DATESTAMP OF THIS PRINT
- DRAWN BY:
- DOCUMENT NUMBER:
- SCHEMATIC FILENAME:
- PCB FILENAME:
- ENGINEER:
- APPROVED:
- CIRCUIT DIAGRAM
- DATE
- SHEET
- REVISION
- OF
- (in symbol IC-PHY-2, part A) Power
- (in symbol IC-PHY-2, part B) SFI/Serial/Clocks
- (in symbol IC-PHY-2, part C) XAUI
- (in symbol IC-PHY-2, part D) Config/Misc

### Library data of the parts
C1-C16 C49-C55 C59 C60 C63-C70 C79 C80 C110 C111 C114 = CAP-CER-1: as C35 on sheet mezzanine; POD number: CAP-CER-1; Value: 0.1uF; RoHS: Y; Sort Value: 0.1; Category: Capacitors; Subcategory: Ceramic
C45-C48 C56 C57 = CAP-CER-3: 4.7uF, Ceramic Capacitor; Manufacturer: MURATA; PartNum: GRM21BR61E475KA12K; Tolerance: 10%; Dielectric: X5R; POD number: CAP-CER-3; Value: 4.7uF; RoHS: Y; Sort Value: 4.7; Category: Capacitors; Subcategory: Ceramic
C71 C72 C74-C78 = CAP-CER-8: 1uF, Ceramic Capacitor; Manufacturer: MURATA; PartNum: GRM21BR61C105KA01L; Tolerance: 10%; Dielectric: X5R; POD number: CAP-CER-8; Value: 1uF; RoHS: Y; Sort Value: 100; Category: Capacitors; Subcategory: Ceramic
L1-L3 = IND-FB-1: 120 Ohm, Chip Ferrite Brad; Manufacturer: Murata; PartNum: BLM31PG121SN1; DC Res: 0.025R; Tolerance: 25%; POD number: IND-FB-1; RoHS: Y; Value: 120R; Sort Value: 120; Category: Inductors; Subcategory: FerriteBead
Q1 Q4 = TRANS-NFET-0: N-Channel Logic Level Enhancement Mode Field Effect Transistor; Manufacturer: Fairchild Semiconductor; Rating: 0.22A; POD number: TRANS-NFET-0; PartNum: BSS138; RoHS: Y; Category: TRANS; Subcategory: NFET
R12-R18 R52-R56 = RES-TF-7: as R7 on sheet mezzanine; POD number: RES-TF-7; Value: 3K3; Sort Value: 3300; Category: Resistors; Subcategory: ThickFilm; HelpURL: http://www.royalohm.com/pdf/general.pdf
TP3 = ELMECH-TP-0: as TP1 on sheet mezzanine; POD number: ELMECH-TP-0; RoHS: Y; Category: ELMECH; Subcategory: Test Points
U1 = IC-PHY-2: DualChannel WAN/LAN/Backplane XAUI to SFP+/KR Transceiver; Manufacturer: Vitesse; POD number: IC-PHY-2; PartNum: VSC8488XJU; RoHS: Y; Category: IC; Subcategory: Network PHY
U5 = IC-MEM-5: 1M, SOIC-8, Serial EEPROM; Manufacturer: Atmel; PartNum: AT24C1024BN-SH-B; POD number: IC-MEM-5; RoHS: Y; Category: IC; Subcategory: Memory

## Sheet phy1.SchDoc: SFP+ PHY 1
size A3; Date: DO NOT USE, RATHER USE PROJ OPTIONS; DrawnBy: DO NOT USE, RATHER USE PROJ OPTIONS; Engineer: DO NOT USE, RATHER USE PROJ OPTIONS; Organization: DO NOT USE, RATHER USE PROJ OPTIONS; DocumentNumber: DO NOT USE, RATHER USE PROJ OPTIONS; Revision: DO NOT USE, RATHER USE PROJ OPTIONS; SheetNumber: 3; SheetTotal: 4; SCH_Sheet_Filename: phy1.SchDoc; CurrentTime: DO NOT USE, RATHER USE PROJ OPTIONS; Time: DO NOT USE, RATHER USE PROJ OPTIONS; DocumentFullPathAndName: DO NOT USE, RATHER USE PROJ OPTIONS; DocumentName: DO NOT USE, RATHER USE PROJ OPTIONS; ModifiedDate: DO NOT USE, RATHER USE PROJ OPTIONS; ImagePath: DO NOT USE, RATHER USE PROJ OPTIONS
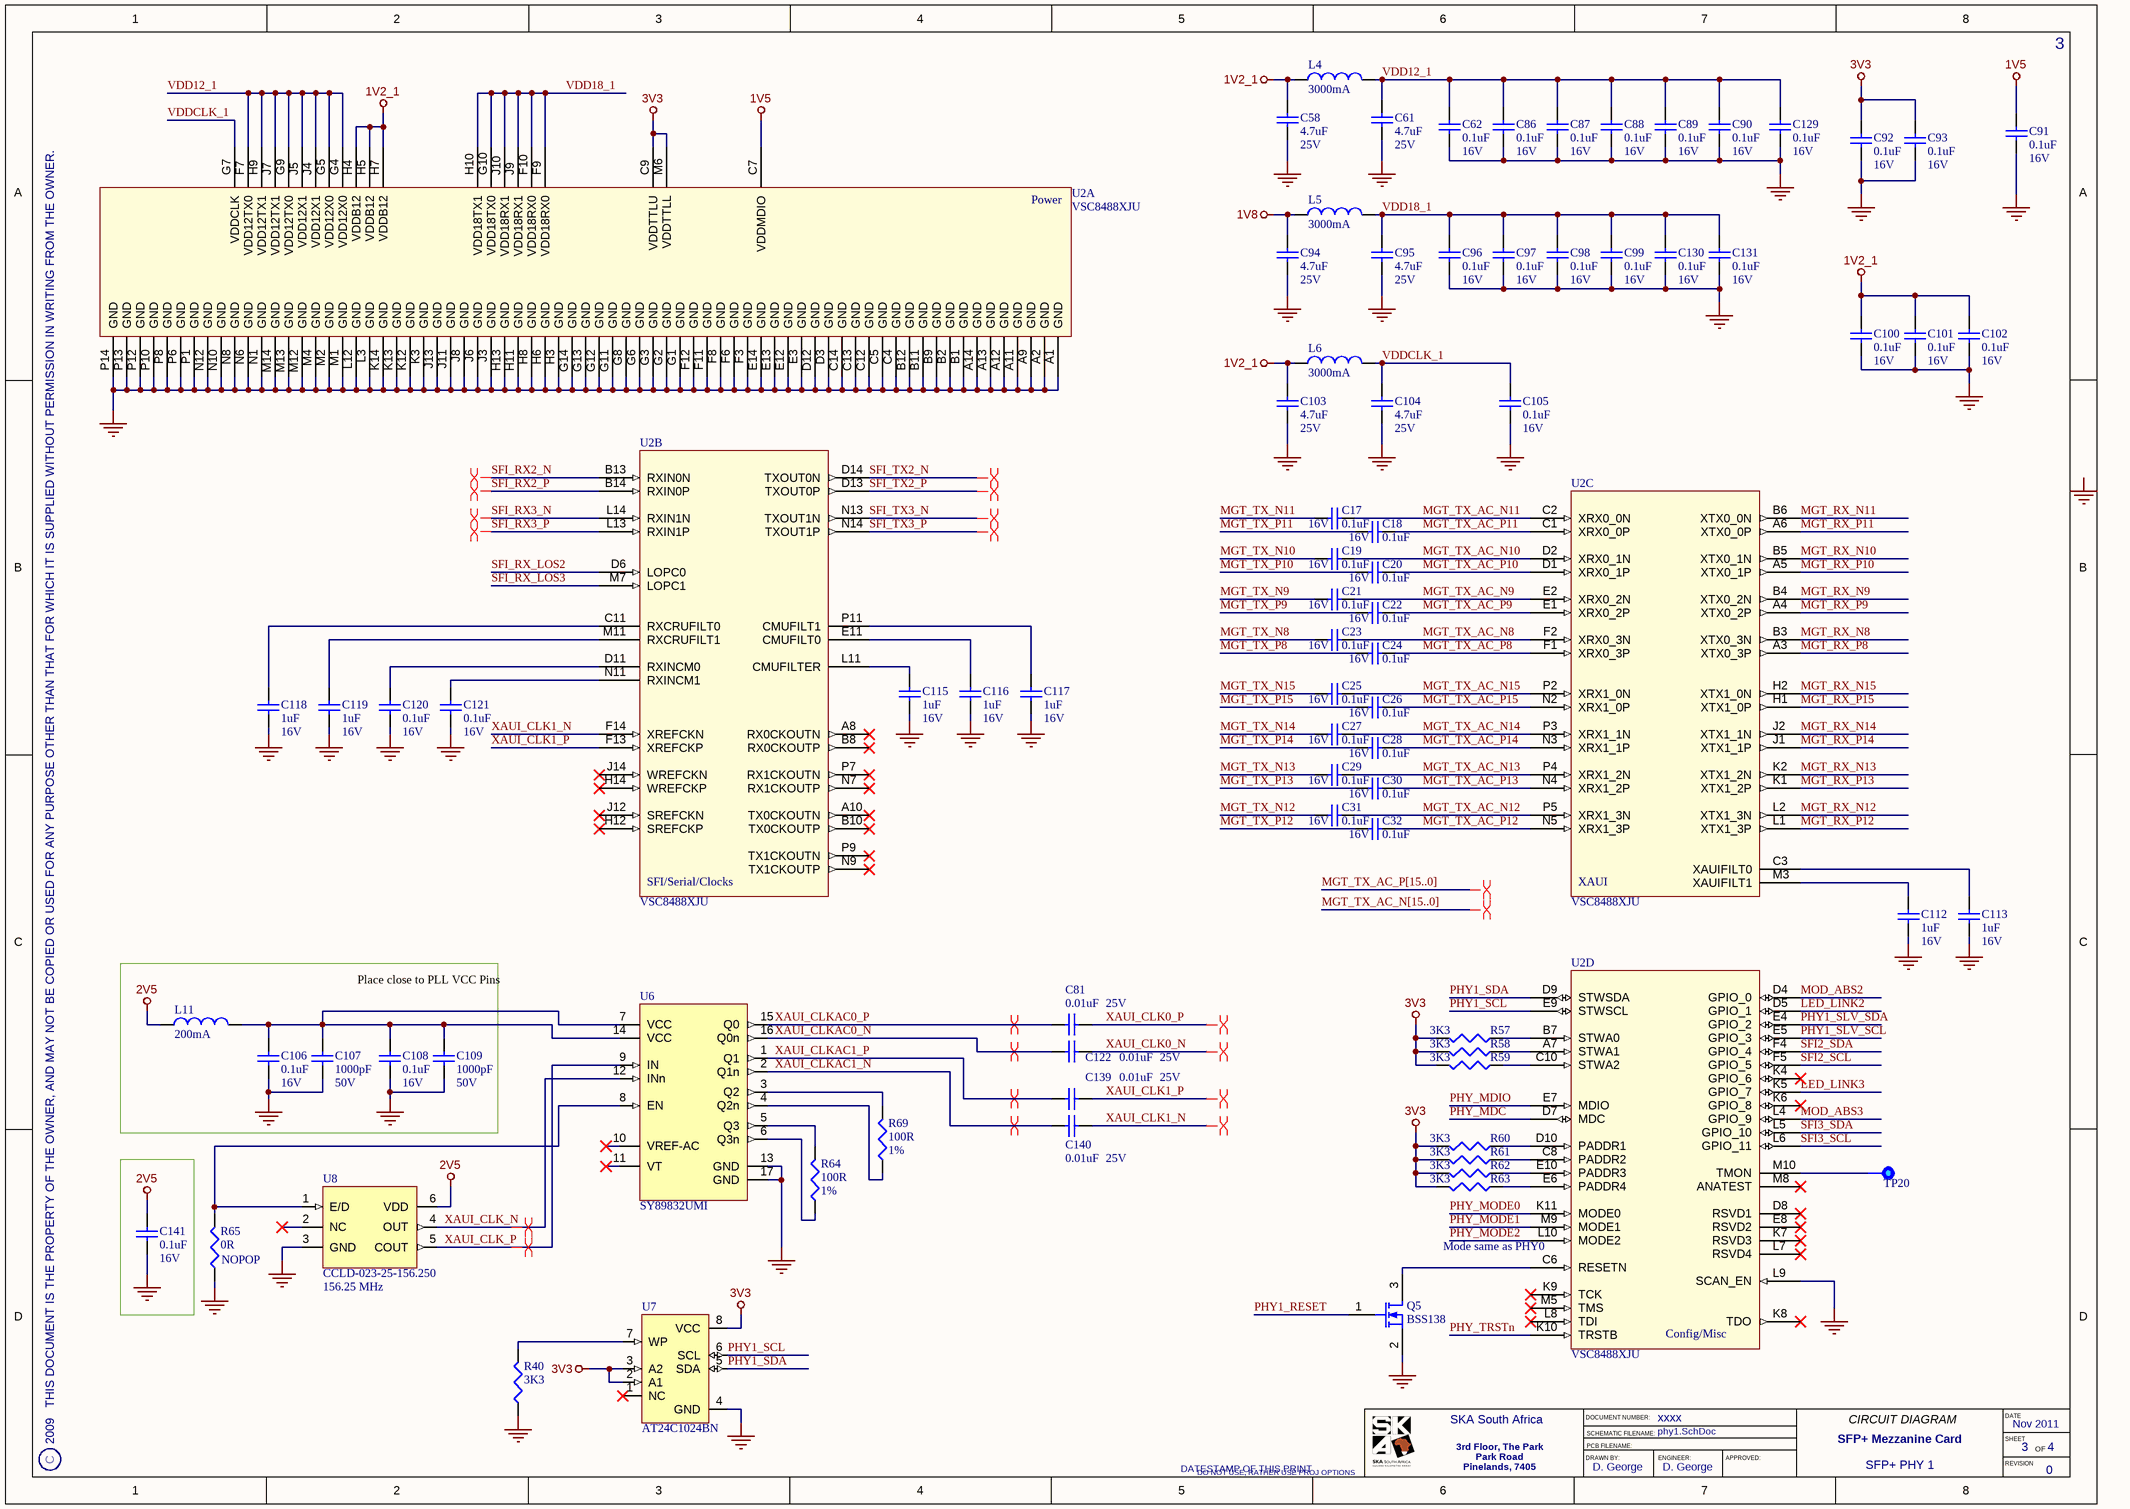
[diagram p2: phy1.SchDoc]

### Parts
C17  Rating: 16V  [CAPC1005X60L]  (hidden comment: 0.1uF)
C18  Rating: 16V  [CAPC1005X60L]  (hidden comment: 0.1uF)
C19  Rating: 16V  [CAPC1005X60L]  (hidden comment: 0.1uF)
C20  Rating: 16V  [CAPC1005X60L]  (hidden comment: 0.1uF)
C21  Rating: 16V  [CAPC1005X60L]  (hidden comment: 0.1uF)
C22  Rating: 16V  [CAPC1005X60L]  (hidden comment: 0.1uF)
C23  Rating: 16V  [CAPC1005X60L]  (hidden comment: 0.1uF)
C24  Rating: 16V  [CAPC1005X60L]  (hidden comment: 0.1uF)
C25  Rating: 16V  [CAPC1005X60L]  (hidden comment: 0.1uF)
C26  Rating: 16V  [CAPC1005X60L]  (hidden comment: 0.1uF)
C27  Rating: 16V  [CAPC1005X60L]  (hidden comment: 0.1uF)
C28  Rating: 16V  [CAPC1005X60L]  (hidden comment: 0.1uF)
C29  Rating: 16V  [CAPC1005X60L]  (hidden comment: 0.1uF)
C30  Rating: 16V  [CAPC1005X60L]  (hidden comment: 0.1uF)
C31  Rating: 16V  [CAPC1005X60L]  (hidden comment: 0.1uF)
C32  Rating: 16V  [CAPC1005X60L]  (hidden comment: 0.1uF)
C58  Rating: 25V  [CAPC2012X127L]  (hidden comment: 4.7uF)
C61  Rating: 25V  [CAPC2012X127L]  (hidden comment: 4.7uF)
C62  Rating: 16V  [CAPC1005X60L]  (hidden comment: 0.1uF)
C81  Rating: 25V  [CAPC1005X55L]  (hidden comment: 0.01uF)
C86  Rating: 16V  [CAPC1005X60L]  (hidden comment: 0.1uF)
C87  Rating: 16V  [CAPC1005X60L]  (hidden comment: 0.1uF)
C88  Rating: 16V  [CAPC1005X60L]  (hidden comment: 0.1uF)
C89  Rating: 16V  [CAPC1005X60L]  (hidden comment: 0.1uF)
C90  Rating: 16V  [CAPC1005X60L]  (hidden comment: 0.1uF)
C91  Rating: 16V  [CAPC1005X60L]  (hidden comment: 0.1uF)
C92  Rating: 16V  [CAPC1005X60L]  (hidden comment: 0.1uF)
C93  Rating: 16V  [CAPC1005X60L]  (hidden comment: 0.1uF)
C94  Rating: 25V  [CAPC2012X127L]  (hidden comment: 4.7uF)
C95  Rating: 25V  [CAPC2012X127L]  (hidden comment: 4.7uF)
C96  Rating: 16V  [CAPC1005X60L]  (hidden comment: 0.1uF)
C97  Rating: 16V  [CAPC1005X60L]  (hidden comment: 0.1uF)
C98  Rating: 16V  [CAPC1005X60L]  (hidden comment: 0.1uF)
C99  Rating: 16V  [CAPC1005X60L]  (hidden comment: 0.1uF)
C100  Rating: 16V  [CAPC1005X60L]  (hidden comment: 0.1uF)
C101  Rating: 16V  [CAPC1005X60L]  (hidden comment: 0.1uF)
C102  Rating: 16V  [CAPC1005X60L]  (hidden comment: 0.1uF)
C103  Rating: 25V  [CAPC2012X127L]  (hidden comment: 4.7uF)
C104  Rating: 25V  [CAPC2012X127L]  (hidden comment: 4.7uF)
C105  Rating: 16V  [CAPC1005X60L]  (hidden comment: 0.1uF)
C106  Rating: 16V  [CAPC1005X60L]  (hidden comment: 0.1uF)
C107  Rating: 50V  [CAPC1005X55L]  (hidden comment: 1000pF)
C108  Rating: 16V  [CAPC1005X60L]  (hidden comment: 0.1uF)
C109  Rating: 50V  [CAPC1005X55L]  (hidden comment: 1000pF)
C112  Rating: 16V  [CAPC2012X127L]  (hidden comment: 1uF)
C113  Rating: 16V  [CAPC2012X127L]  (hidden comment: 1uF)
C115  Rating: 16V  [CAPC2012X127L]  (hidden comment: 1uF)
C116  Rating: 16V  [CAPC2012X127L]  (hidden comment: 1uF)
C117  Rating: 16V  [CAPC2012X127L]  (hidden comment: 1uF)
C118  Rating: 16V  [CAPC2012X127L]  (hidden comment: 1uF)
C119  Rating: 16V  [CAPC2012X127L]  (hidden comment: 1uF)
C120  Rating: 16V  [CAPC1005X60L]  (hidden comment: 0.1uF)
C121  Rating: 16V  [CAPC1005X60L]  (hidden comment: 0.1uF)
C122  Rating: 25V  [CAPC1005X55L]  (hidden comment: 0.01uF)
C129  Rating: 16V  [CAPC1005X60L]  (hidden comment: 0.1uF)
C130  Rating: 16V  [CAPC1005X60L]  (hidden comment: 0.1uF)
C131  Rating: 16V  [CAPC1005X60L]  (hidden comment: 0.1uF)
C139  Rating: 25V  [CAPC1005X55L]  (hidden comment: 0.01uF)
C140  Rating: 25V  [CAPC1005X55L]  (hidden comment: 0.01uF)
C141  Rating: 16V  [CAPC1005X60L]  (hidden comment: 0.1uF)
L4  Rating: 3000mA  [INDC3216X130L]  (hidden comment: 120R)
L5  Rating: 3000mA  [INDC3216X130L]  (hidden comment: 120R)
L6  Rating: 3000mA  [INDC3216X130L]  (hidden comment: 120R)
L11  Rating: 200mA  [INDC2012X130L]  (hidden comment: 600R)
Q5  BSS138  [SOT95P245X110-3N]
R40  3K3  [RESC1005X40L]
R57  3K3  [RESC1005X40L]
R58  3K3  [RESC1005X40L]
R59  3K3  [RESC1005X40L]
R60  3K3  [RESC1005X40L]
R61  3K3  [RESC1005X40L]
R62  3K3  [RESC1005X40L]
R63  3K3  [RESC1005X40L]
R64  Tolerance: 1%  [RESC1005X40L]  (hidden comment: 100R)
R65  0R  [RESC1005X40L]
R69  Tolerance: 1%  [RESC1005X40L]  (hidden comment: 100R)
TP20  Testpoint  [TP100]  (value not drawn)  (no BOM)
U2  VSC8488XJU  [BGA196C100P14X14_1500x1500x140]  (parts A,B,C,D of 4)
U6  SY89832UMI  [MLF-16]
U7  AT24C1024BN  [SOIC150-8_N]
U8  Frequency: 156.25 MHz  [CCLD-023X-XX-XXX_XXX]  (hidden comment: CCLD-023-25-156.250)

### Nets
1V2_1: C58.2 C100.2 C101.2 C102.2 C103.2 L4.1 L6.1 U2.H4(VDDB12) U2.H5(VDDB12) U2.H7(VDDB12)
1V5: C91.2 U2.C7(VDDMDIO)
1V8: C94.2 L5.1
2V5: C141.2 L11.1 U8.6(VDD)
3V3: C92.2 C93.2 R57.2 R58.2 R59.2 R60.2 R61.2 R62.2 R63.2 U2.C9(VDDTTLU) U2.M6(VDDTTLL) U7.2(A1) U7.3(A2) U7.8(VCC)
GND: C58.1 C61.1 C62.1 C86.1 C87.1 C88.1 C89.1 C90.1 C91.1 C92.1 C93.1 C94.1 C95.1 C96.1 C97.1 C98.1 C99.1 C100.1 C101.1 C102.1 C104.1 C105.1 C106.1 C107.1 C108.1 C109.1 C112.2 C113.2 C115.2 C116.2 C117.2 C118.2 C119.2 C120.1 C121.1 C129.1 C130.1 C131.1 C141.1 Q5.2(S) R40.1 R65.1 U2.A1(GND) U2.A2(GND) U2.A9(GND) U2.A11(GND) U2.A12(GND) U2.A13(GND) U2.A14(GND) U2.B1(GND) U2.B2(GND) U2.B9(GND) U2.B11(GND) U2.B12(GND) U2.C4(GND) U2.C5(GND) U2.C12(GND) U2.C13(GND) U2.C14(GND) U2.D3(GND) U2.D12(GND) U2.E3(GND) U2.E12(GND) U2.E13(GND) U2.E14(GND) U2.F3(GND) U2.F6(GND) U2.F8(GND) U2.F11(GND) U2.F12(GND) U2.G1(GND) U2.G2(GND) U2.G3(GND) U2.G6(GND) U2.G8(GND) U2.G11(GND) U2.G12(GND) U2.G13(GND) U2.G14(GND) U2.H3(GND) U2.H6(GND) U2.H8(GND) U2.H11(GND) U2.H13(GND) U2.J3(GND) U2.J6(GND) U2.J8(GND) U2.J11(GND) U2.J13(GND) U2.K3(GND) U2.K12(GND) U2.K13(GND) U2.K14(GND) U2.L3(GND) U2.L9(SCAN_EN) U2.L12(GND) U2.M1(GND) U2.M2(GND) U2.M4(GND) U2.M12(GND) U2.M13(GND) U2.M14(GND) U2.N1(GND) U2.N6(GND) U2.N8(GND) U2.N10(GND) U2.N12(GND) U2.P1(GND) U2.P6(GND) U2.P8(GND) U2.P10(GND) U2.P12(GND) U2.P13(GND) U2.P14(GND) U6.13(GND) U6.17(GND) U7.4(GND) U8.3(GND)
LED_LINK2: U2.D5(GPIO_1)
LED_LINK3: U2.K5(GPIO_7)
MGT_RX_N8: U2.B3(XTX0_3N)
MGT_RX_N9: U2.B4(XTX0_2N)
MGT_RX_N10: U2.B5(XTX0_1N)
MGT_RX_N11: U2.B6(XTX0_0N)
MGT_RX_N12: U2.L2(XTX1_3N)
MGT_RX_N13: U2.K2(XTX1_2N)
MGT_RX_N14: U2.J2(XTX1_1N)
MGT_RX_N15: U2.H2(XTX1_0N)
MGT_RX_P8: U2.A3(XTX0_3P)
MGT_RX_P9: U2.A4(XTX0_2P)
MGT_RX_P10: U2.A5(XTX0_1P)
MGT_RX_P11: U2.A6(XTX0_0P)
MGT_RX_P12: U2.L1(XTX1_3P)
MGT_RX_P13: U2.K1(XTX1_2P)
MGT_RX_P14: U2.J1(XTX1_1P)
MGT_RX_P15: U2.H1(XTX1_0P)
MGT_TX_AC_N8: C23.1 U2.F2(XRX0_3N)
MGT_TX_AC_N9: C21.1 U2.E2(XRX0_2N)
MGT_TX_AC_N10: C19.1 U2.D2(XRX0_1N)
MGT_TX_AC_N11: C17.1 U2.C2(XRX0_0N)
MGT_TX_AC_N12: C31.1 U2.P5(XRX1_3N)
MGT_TX_AC_N13: C29.1 U2.P4(XRX1_2N)
MGT_TX_AC_N14: C27.1 U2.P3(XRX1_1N)
MGT_TX_AC_N15: C25.1 U2.P2(XRX1_0N)
MGT_TX_AC_P8: C24.1 U2.F1(XRX0_3P)
MGT_TX_AC_P9: C22.1 U2.E1(XRX0_2P)
MGT_TX_AC_P10: C20.1 U2.D1(XRX0_1P)
MGT_TX_AC_P11: C18.1 U2.C1(XRX0_0P)
MGT_TX_AC_P12: C32.1 U2.N5(XRX1_3P)
MGT_TX_AC_P13: C30.1 U2.N4(XRX1_2P)
MGT_TX_AC_P14: C28.1 U2.N3(XRX1_1P)
MGT_TX_AC_P15: C26.1 U2.N2(XRX1_0P)
MGT_TX_N8: C23.2
MGT_TX_N9: C21.2
MGT_TX_N10: C19.2
MGT_TX_N11: C17.2
MGT_TX_N12: C31.2
MGT_TX_N13: C29.2
MGT_TX_N14: C27.2
MGT_TX_N15: C25.2
MGT_TX_P8: C24.2
MGT_TX_P9: C22.2
MGT_TX_P10: C20.2
MGT_TX_P11: C18.2
MGT_TX_P12: C32.2
MGT_TX_P13: C30.2
MGT_TX_P14: C28.2
MGT_TX_P15: C26.2
MOD_ABS2: U2.D4(GPIO_0)
MOD_ABS3: U2.L4(GPIO_9)
PHY1_RESET: Q5.1(G)
PHY1_SCL: U2.E9(STWSCL) U7.6(SCL)
PHY1_SDA: U2.D9(STWSDA) U7.5(SDA)
PHY1_SLV_SCL: U2.E5(GPIO_3)
PHY1_SLV_SDA: U2.E4(GPIO_2)
PHY_MDC: U2.D7(MDC)
PHY_MDIO: U2.E7(MDIO)
PHY_MODE0: U2.K11(MODE0)
PHY_MODE1: U2.M9(MODE1)
PHY_MODE2: U2.L10(MODE2)
PHY_TRSTn: U2.K10(TRSTB)
SFI2_SCL: U2.F5(GPIO_5)
SFI2_SDA: U2.F4(GPIO_4)
SFI3_SCL: U2.L6(GPIO_11)
SFI3_SDA: U2.L5(GPIO_10)
SFI_RX2_N: U2.B13(RXIN0N)
SFI_RX2_P: U2.B14(RXIN0P)
SFI_RX3_N: U2.L14(RXIN1N)
SFI_RX3_P: U2.L13(RXIN1P)
SFI_RX_LOS2: U2.D6(LOPC0)
SFI_RX_LOS3: U2.M7(LOPC1)
SFI_TX2_N: U2.D14(TXOUT0N)
SFI_TX2_P: U2.D13(TXOUT0P)
SFI_TX3_N: U2.N13(TXOUT1N)
SFI_TX3_P: U2.N14(TXOUT1P)
VDD12_1: C61.2 C62.2 C86.2 C87.2 C88.2 C89.2 C90.2 C129.2 L4.2 U2.F7(VDD12TX0) U2.G4(VDD12X0) U2.G5(VDD12X0) U2.G9(VDD12TX0) U2.H9(VDD12TX1) U2.J4(VDD12X1) U2.J5(VDD12X1) U2.J7(VDD12TX1)
VDD18_1: C95.2 C96.2 C97.2 C98.2 C99.2 C130.2 C131.2 L5.2 U2.F9(VDD18RX0) U2.F10(VDD18RX0) U2.G10(VDD18TX0) U2.H10(VDD18TX1) U2.J9(VDD18RX1) U2.J10(VDD18RX1)
VDDCLK_1: C104.2 C105.2 L6.2 U2.G7(VDDCLK)
XAUI_CLK0_N: C122.2
XAUI_CLK0_P: C81.2
XAUI_CLK1_N: C140.2 U2.F14(XREFCKN)
XAUI_CLK1_P: C139.2 U2.F13(XREFCKP)
XAUI_CLK_N: U6.12(INn) U8.4(OUT)
XAUI_CLK_P: U6.9(IN) U8.5(COUT)
XAUI_CLKAC0_N: C122.1 U6.16(Q0n)
XAUI_CLKAC0_P: C81.1 U6.15(Q0)
XAUI_CLKAC1_N: C140.1 U6.2(Q1n)
XAUI_CLKAC1_P: C139.1 U6.1(Q1)
NetC106_2: C106.2 C107.2 C108.2 C109.2 L11.2 U6.7(VCC) U6.14(VCC)
NetC112_1: C112.1 U2.M3(XAUIFILT1)
NetC113_1: C113.1 U2.C3(XAUIFILT0)
NetC115_1: C115.1 U2.L11(CMUFILTER)
NetC116_1: C116.1 U2.E11(CMUFILT0)
NetC117_1: C117.1 U2.P11(CMUFILT1)
NetC118_1: C118.1 U2.C11(RXCRUFILT0)
NetC119_1: C119.1 U2.M11(RXCRUFILT1)
NetC120_2: C120.2 U2.D11(RXINCM0)
NetC121_2: C121.2 U2.N11(RXINCM1)
NetQ5_3: Q5.3(D) U2.C6(RESETN)
NetR40_2: R40.2 U7.7(WP)
NetR57_1: R57.1 U2.B7(STWA0)
NetR58_1: R58.1 U2.A7(STWA1)
NetR59_1: R59.1 U2.C10(STWA2)
NetR60_1: R60.1 U2.D10(PADDR1)
NetR61_1: R61.1 U2.C8(PADDR2)
NetR62_1: R62.1 U2.E10(PADDR3)
NetR63_1: R63.1 U2.E6(PADDR4)
NetR64_1: R64.1 U6.6(Q3n)
NetR64_2: R64.2 U6.5(Q3)
NetR65_2: R65.2 U6.8(EN) U8.1(E/D)
NetR69_1: R69.1 U6.4(Q2n)
NetR69_2: R69.2 U6.3(Q2)
NetTP20_1: TP20.1 U2.M10(TMON)

Not connected (* = marked no-connect by the designer): C103 1; U2 A8(RX0CKOUTN)* A10(TX0CKOUTN)* B8(RX0CKOUTP)* B10(TX0CKOUTP)* D8(RSVD1)* E8(RSVD2)* H12(SREFCKP)* H14(WREFCKP)* J12(SREFCKN)* J14(WREFCKN)* K4(GPIO_6)* K6(GPIO_8)* K7(RSVD3)* K8(TDO)* K9(TCK)* L7(RSVD4)* L8(TDI)* M5(TMS)* M8(ANATEST)* N7(RX1CKOUTP)* N9(TX1CKOUTP)* P7(RX1CKOUTN)* P9(TX1CKOUTN)*; U6 10(VREF-AC)* 11(VT)*; U7 1(NC)*; U8 2(NC)*

### Buses and harness runs
bus MGT_TX_AC_N[15..0]
bus MGT_TX_AC_P[15..0]

### Layout directives
differential pair: (no net found under the mark), SFI_RX2_N, SFI_RX2_P, SFI_RX3_N, SFI_RX3_P, SFI_TX2_N, SFI_TX2_P, SFI_TX3_N, SFI_TX3_P, XAUI_CLK0_N, XAUI_CLK0_P, XAUI_CLK1_N, XAUI_CLK1_P, XAUI_CLK_N, XAUI_CLK_P, XAUI_CLKAC0_N, XAUI_CLKAC0_P, XAUI_CLKAC1_N, XAUI_CLKAC1_P

### Notes on the sheet
- Place close to PLL VCC Pins
- (near R65) NOPOP
- (near U2) Mode same as PHY0
- Labels drawn without touching a wire or pin: GND
- 2009   THIS DOCUMENT IS THE PROPERTY OF THE OWNER, AND MAY NOT BE COPIED OR USED FOR ANY PURPOSE OTHER THAN THAT FOR WHICH IT IS SUPPLIED WITHOUT PERMISSION IN WRITING FROM THE OWNER.
- C
- DATESTAMP OF THIS PRINT
- DRAWN BY:
- DOCUMENT NUMBER:
- SCHEMATIC FILENAME:
- PCB FILENAME:
- ENGINEER:
- APPROVED:
- CIRCUIT DIAGRAM
- DATE
- SHEET
- REVISION
- OF
- (in symbol IC-PHY-2, part A) Power
- (in symbol IC-PHY-2, part B) SFI/Serial/Clocks
- (in symbol IC-PHY-2, part C) XAUI
- (in symbol IC-PHY-2, part D) Config/Misc

### Library data of the parts
C17-C32 C62 C86-C93 C96-C102 C105 C106 C108 C120 C121 C129-C131 C141 = CAP-CER-1: as C35 on sheet mezzanine; POD number: CAP-CER-1; Value: 0.1uF; RoHS: Y; Sort Value: 0.1; Category: Capacitors; Subcategory: Ceramic
C58 C61 C94 C95 C103 C104 = CAP-CER-3: as C45 on sheet phy0; POD number: CAP-CER-3; Value: 4.7uF; RoHS: Y; Sort Value: 4.7; Category: Capacitors; Subcategory: Ceramic
C81 C122 C139 C140 = CAP-CER-6: as C38 on sheet mezzanine; POD number: CAP-CER-6; Value: 0.01uF; RoHS: Y; Sort Value: 0.01; Category: Capacitors; Subcategory: Ceramic
C107 C109 = CAP-CER-4: 1000pF, Ceramic Capacitor; Manufacturer: MURATA; PartNum: GRM155R61H102KA01D; Tolerance: 10%; Dielectric: X5R; POD number: CAP-CER-4; Value: 1000pF; RoHS: Y; Sort Value: 0.0001; Category: Capacitors; Subcategory: Ceramic
C112 C113 C115-C119 = CAP-CER-8: as C71 on sheet phy0; POD number: CAP-CER-8; Value: 1uF; RoHS: Y; Sort Value: 100; Category: Capacitors; Subcategory: Ceramic
L4-L6 = IND-FB-1: as L1 on sheet phy0; POD number: IND-FB-1; RoHS: Y; Value: 120R; Sort Value: 120; Category: Inductors; Subcategory: FerriteBead
L11 = IND-FB-0: 600 Ohm, Chip Ferrite Bead; Manufacturer: Murata; PartNum: BLM21BD601SN1; DC Res: 0.35R; Tolerance: 25%; POD number: IND-FB-0; RoHS: Y; Value: 600R; Sort Value: 600; Category: Inductors; Subcategory: FerriteBead
Q5 = TRANS-NFET-0: as Q1 on sheet phy0; POD number: TRANS-NFET-0; PartNum: BSS138; RoHS: Y; Category: TRANS; Subcategory: NFET
R40 R57-R63 = RES-TF-7: as R7 on sheet mezzanine; POD number: RES-TF-7; Value: 3K3; Sort Value: 3300; Category: Resistors; Subcategory: ThickFilm; HelpURL: http://www.royalohm.com/pdf/general.pdf
R64 R69 = RES-TF-14: 100R, 1.1mm x 0.5mm, Thick Film Resistor; Manufacturer: ROYALOHM; PartNum: 0402WGF0101T1E; Rating: 0.0625W; POD number: RES-TF-14; Value: 100R; Sort Value: 1000; Category: Resistors; Subcategory: ThickFilm; HelpURL: *.pdf
R65 = RES-TF-0: 0R, 1.1mm x 0.5mm, Thick Film Resistor; Manufacturer: ROYALOHM; PartNum: 0402WG00000T1E; Tolerance: 0%; Rating: 0.0625W; POD number: RES-TF-0; Value: 0R; Sort Value: 0; Category: Resistors; Subcategory: ThickFilm; HelpURL: *.pdf
TP20 = ELMECH-TP-0: as TP1 on sheet mezzanine; POD number: ELMECH-TP-0; RoHS: Y; Category: ELMECH; Subcategory: Test Points
U2 = IC-PHY-2: as U1 on sheet phy0; POD number: IC-PHY-2; PartNum: VSC8488XJU; RoHS: Y; Category: IC; Subcategory: Network PHY
U6 = IC-LOG-14: 2.5 C Ultra-precision 1:4 LVDS Fanout Buffer/Translator with Interal Termination; Manufacturer: Micrel; POD number: IC-LOG-14; PartNum: SY89832UMI; RoHS: Y; Category: IC; Subcategory: Logic
U7 = IC-MEM-5: as U5 on sheet phy0; POD number: IC-MEM-5; RoHS: Y; Category: IC; Subcategory: Memory
U8 = RESN-CLK-4: 156.25 MHz, Low-Jitter Differential LVDS Clock Oscillator; Manufacturer: Crystek; Stability: 25 PPM; POD number: RESN-CLK-4; PartNum: CCLD-023-25-156.250; RoHS: Y; Category: RESN; Subcategory: Clock Oscillators

## Sheet sfpp_conn.SchDoc: SFP+ connectors
size A3; Date: DO NOT USE, RATHER USE PROJ OPTIONS; DrawnBy: DO NOT USE, RATHER USE PROJ OPTIONS; Engineer: DO NOT USE, RATHER USE PROJ OPTIONS; Organization: DO NOT USE, RATHER USE PROJ OPTIONS; DocumentNumber: DO NOT USE, RATHER USE PROJ OPTIONS; Revision: DO NOT USE, RATHER USE PROJ OPTIONS; SheetNumber: 4; SheetTotal: 4; SCH_Sheet_Filename: sfpp_conn.SchDoc; CurrentTime: DO NOT USE, RATHER USE PROJ OPTIONS; Time: DO NOT USE, RATHER USE PROJ OPTIONS; DocumentFullPathAndName: DO NOT USE, RATHER USE PROJ OPTIONS; DocumentName: DO NOT USE, RATHER USE PROJ OPTIONS; ModifiedDate: DO NOT USE, RATHER USE PROJ OPTIONS; ImagePath: DO NOT USE, RATHER USE PROJ OPTIONS
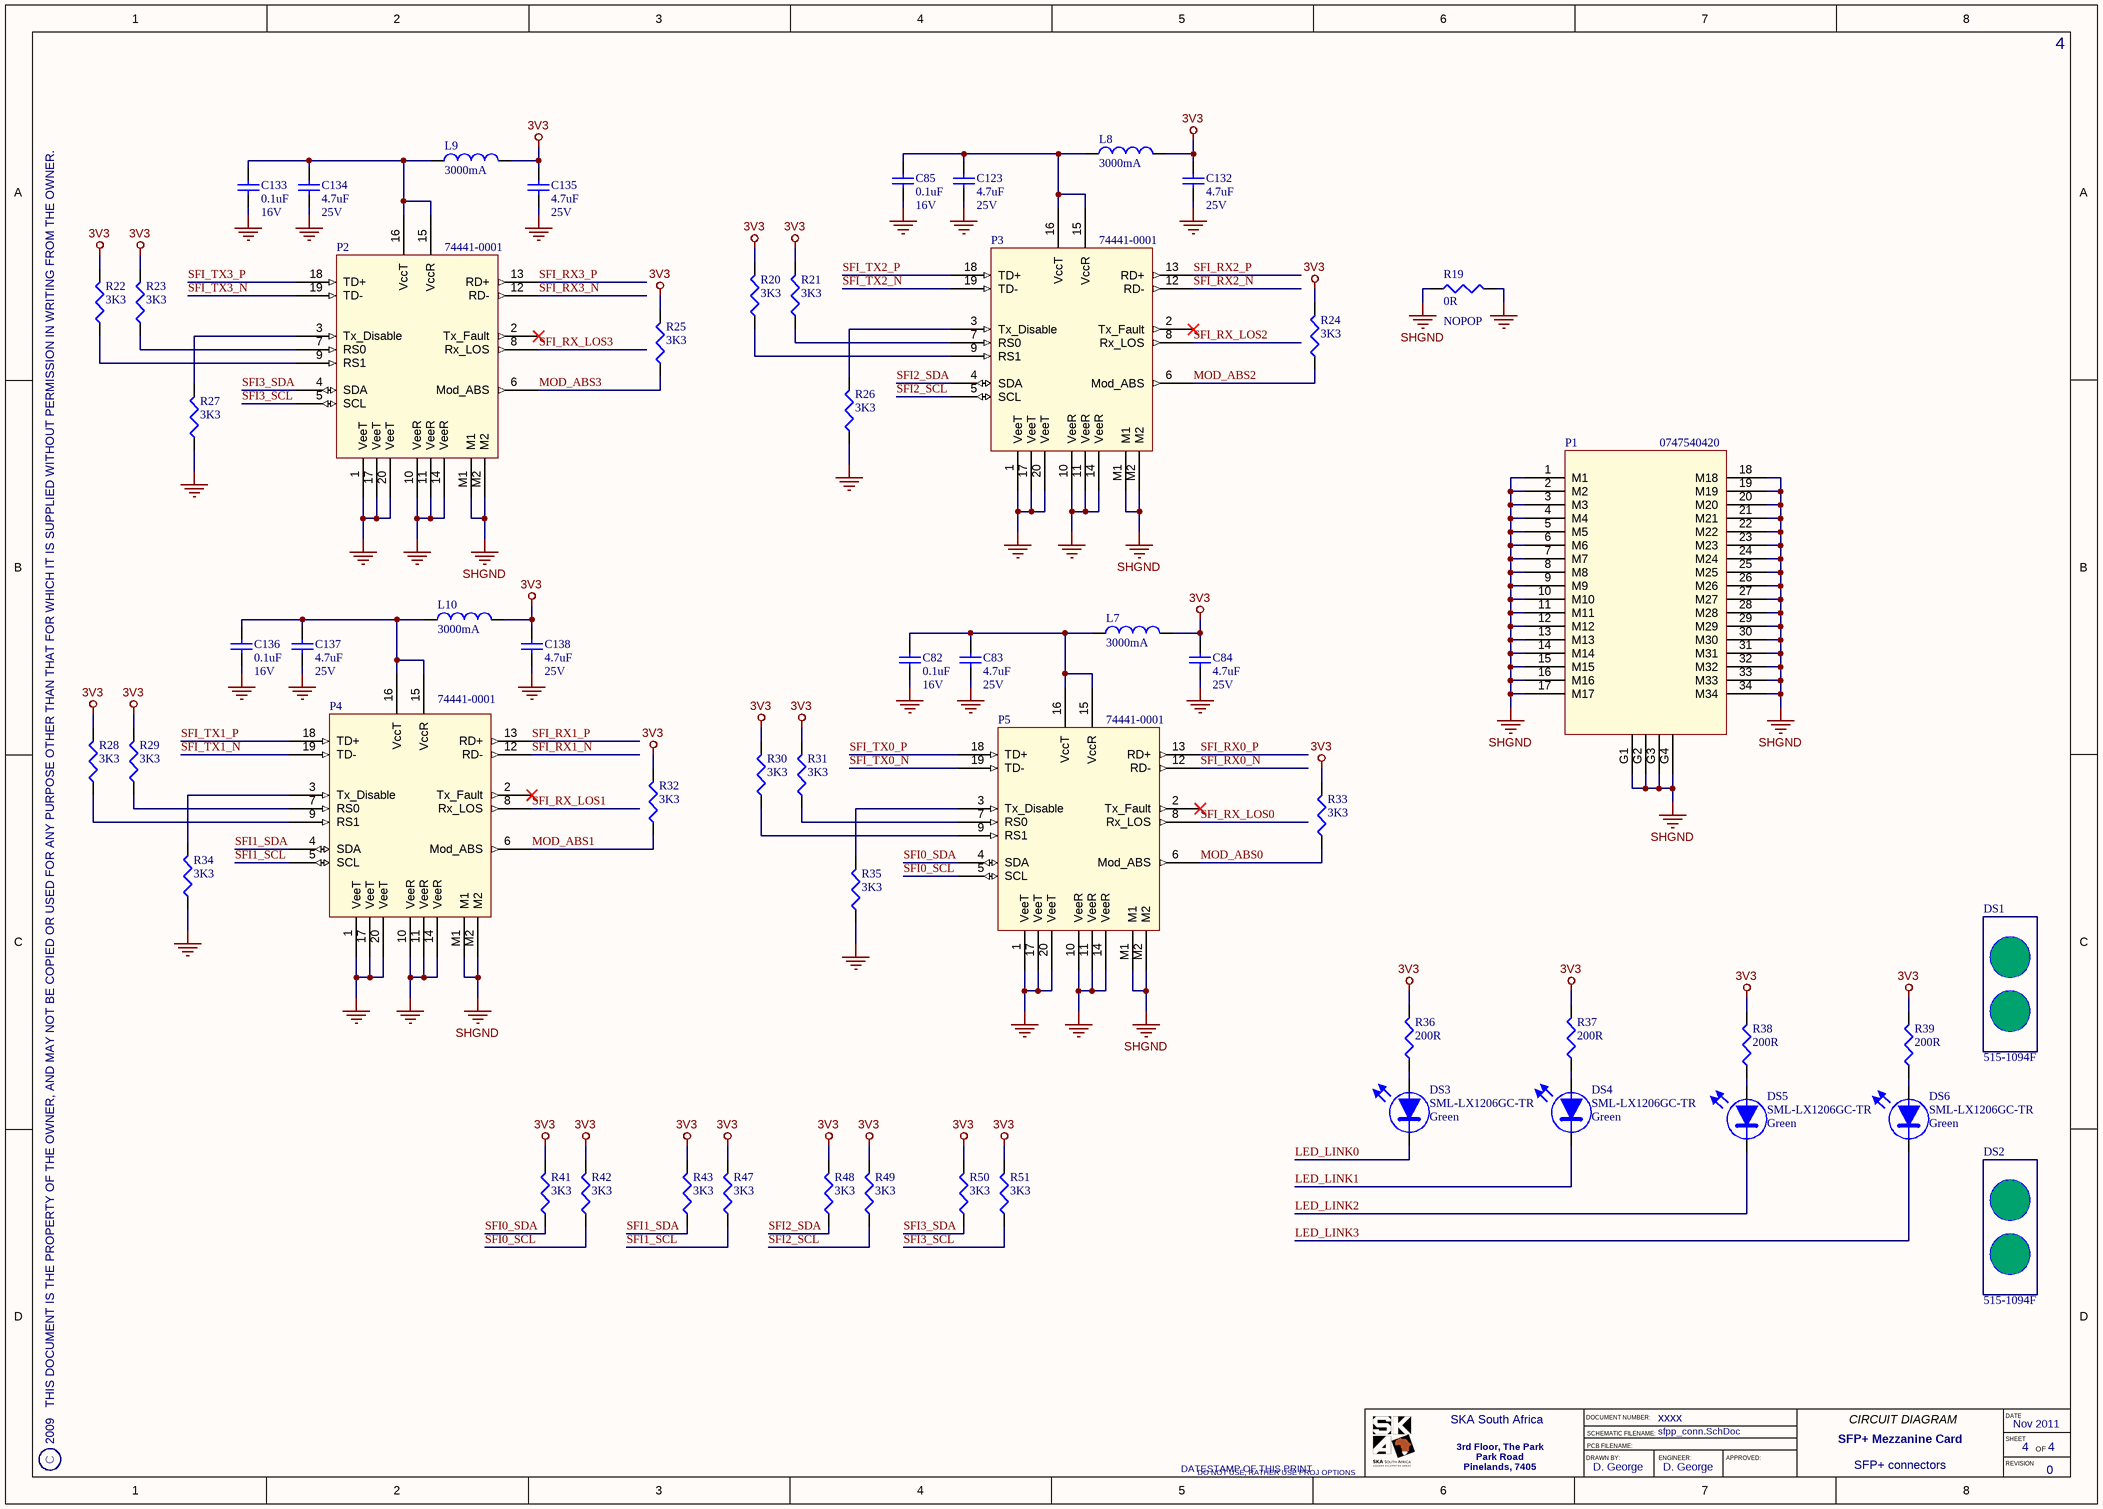
[diagram p3: sfpp_conn.SchDoc]

### Parts
C82  Rating: 16V  [CAPC1005X60L]  (hidden comment: 0.1uF)
C83  Rating: 25V  [CAPC2012X127L]  (hidden comment: 4.7uF)
C84  Rating: 25V  [CAPC2012X127L]  (hidden comment: 4.7uF)
C85  Rating: 16V  [CAPC1005X60L]  (hidden comment: 0.1uF)
C123  Rating: 25V  [CAPC2012X127L]  (hidden comment: 4.7uF)
C132  Rating: 25V  [CAPC2012X127L]  (hidden comment: 4.7uF)
C133  Rating: 16V  [CAPC1005X60L]  (hidden comment: 0.1uF)
C134  Rating: 25V  [CAPC2012X127L]  (hidden comment: 4.7uF)
C135  Rating: 25V  [CAPC2012X127L]  (hidden comment: 4.7uF)
C136  Rating: 16V  [CAPC1005X60L]  (hidden comment: 0.1uF)
C137  Rating: 25V  [CAPC2012X127L]  (hidden comment: 4.7uF)
C138  Rating: 25V  [CAPC2012X127L]  (hidden comment: 4.7uF)
DS1  515-1094F  [DIALIGHT_515-1094F]
DS2  515-1094F  [DIALIGHT_515-1094F]
DS3  SML-LX1206GC-TR  Colour: Green  [LEDC3216X120N]
DS4  SML-LX1206GC-TR  Colour: Green  [LEDC3216X120N]
DS5  SML-LX1206GC-TR  Colour: Green  [LEDC3216X120N]
DS6  SML-LX1206GC-TR  Colour: Green  [LEDC3216X120N]
L7  Rating: 3000mA  [INDC3216X130L]  (hidden comment: 120R)
L8  Rating: 3000mA  [INDC3216X130L]  (hidden comment: 120R)
L9  Rating: 3000mA  [INDC3216X130L]  (hidden comment: 120R)
L10  Rating: 3000mA  [INDC3216X130L]  (hidden comment: 120R)
P1  0747540420  [MOLEX_0747540420]
P2  74441-0001  [MOLEX_74441-0001]
P3  74441-0001  [MOLEX_74441-0001]
P4  74441-0001  [MOLEX_74441-0001]
P5  74441-0001  [MOLEX_74441-0001]
R19  0R  [RESC1005X40L]
R20  3K3  [RESC1005X40L]
R21  3K3  [RESC1005X40L]
R22  3K3  [RESC1005X40L]
R23  3K3  [RESC1005X40L]
R24  3K3  [RESC1005X40L]
R25  3K3  [RESC1005X40L]
R26  3K3  [RESC1005X40L]
R27  3K3  [RESC1005X40L]
R28  3K3  [RESC1005X40L]
R29  3K3  [RESC1005X40L]
R30  3K3  [RESC1005X40L]
R31  3K3  [RESC1005X40L]
R32  3K3  [RESC1005X40L]
R33  3K3  [RESC1005X40L]
R34  3K3  [RESC1005X40L]
R35  3K3  [RESC1005X40L]
R36  200R  [RESC1005X40L]
R37  200R  [RESC1005X40L]
R38  200R  [RESC1005X40L]
R39  200R  [RESC1005X40L]
R41  3K3  [RESC1005X40L]
R42  3K3  [RESC1005X40L]
R43  3K3  [RESC1005X40L]
R47  3K3  [RESC1005X40L]
R48  3K3  [RESC1005X40L]
R49  3K3  [RESC1005X40L]
R50  3K3  [RESC1005X40L]
R51  3K3  [RESC1005X40L]

### Nets
3V3: C84.2 C132.2 C135.2 C138.2 L7.2 L8.2 L9.2 L10.2 R20.2 R21.2 R22.2 R23.2 R24.2 R25.2 R28.2 R29.2 R30.2 R31.2 R32.2 R33.2 R36.2 R37.2 R38.2 R39.2 R41.2 R42.2 R43.2 R47.2 R48.2 R49.2 R50.2 R51.2
GND: C82.1 C83.1 C84.1 C85.1 C123.1 C132.1 C133.1 C134.1 C135.1 C136.1 C137.1 C138.1 P2.1(VeeT) P2.10(VeeR) P2.11(VeeR) P2.14(VeeR) P2.17(VeeT) P2.20(VeeT) P3.1(VeeT) P3.10(VeeR) P3.11(VeeR) P3.14(VeeR) P3.17(VeeT) P3.20(VeeT) P4.1(VeeT) P4.10(VeeR) P4.11(VeeR) P4.14(VeeR) P4.17(VeeT) P4.20(VeeT) P5.1(VeeT) P5.10(VeeR) P5.11(VeeR) P5.14(VeeR) P5.17(VeeT) P5.20(VeeT) R19.2 R26.1 R27.1 R34.1 R35.1
SHGND: P1.1(M1) P1.2(M2) P1.3(M3) P1.4(M4) P1.5(M5) P1.6(M6) P1.7(M7) P1.8(M8) P1.9(M9) P1.10(M10) P1.11(M11) P1.12(M12) P1.13(M13) P1.14(M14) P1.15(M15) P1.16(M16) P1.17(M17) P1.18(M18) P1.19(M19) P1.20(M20) P1.21(M21) P1.22(M22) P1.23(M23) P1.24(M24) P1.25(M25) P1.26(M26) P1.27(M27) P1.28(M28) P1.29(M29) P1.30(M30) P1.31(M31) P1.32(M32) P1.33(M33) P1.34(M34) P1.G1 P1.G2 P1.G3 P1.G4 P2.M1 P2.M2 P3.M1 P3.M2 P4.M1 P4.M2 P5.M1 P5.M2 R19.1
LED_LINK0: DS3.1(K)
LED_LINK1: DS4.1(K)
LED_LINK2: DS5.1(K)
LED_LINK3: DS6.1(K)
MOD_ABS0: P5.6(Mod_ABS) R33.1
MOD_ABS1: P4.6(Mod_ABS) R32.1
MOD_ABS2: P3.6(Mod_ABS) R24.1
MOD_ABS3: P2.6(Mod_ABS) R25.1
SFI0_SCL: P5.5(SCL) R42.1
SFI0_SDA: P5.4(SDA) R41.1
SFI1_SCL: P4.5(SCL) R47.1
SFI1_SDA: P4.4(SDA) R43.1
SFI2_SCL: P3.5(SCL) R49.1
SFI2_SDA: P3.4(SDA) R48.1
SFI3_SCL: P2.5(SCL) R51.1
SFI3_SDA: P2.4(SDA) R50.1
SFI_RX0_N: P5.12(RD-)
SFI_RX0_P: P5.13(RD+)
SFI_RX1_N: P4.12(RD-)
SFI_RX1_P: P4.13(RD+)
SFI_RX2_N: P3.12(RD-)
SFI_RX2_P: P3.13(RD+)
SFI_RX3_N: P2.12(RD-)
SFI_RX3_P: P2.13(RD+)
SFI_RX_LOS0: P5.8(Rx_LOS)
SFI_RX_LOS1: P4.8(Rx_LOS)
SFI_RX_LOS2: P3.8(Rx_LOS)
SFI_RX_LOS3: P2.8(Rx_LOS)
SFI_TX0_N: P5.19(TD-)
SFI_TX0_P: P5.18(TD+)
SFI_TX1_N: P4.19(TD-)
SFI_TX1_P: P4.18(TD+)
SFI_TX2_N: P3.19(TD-)
SFI_TX2_P: P3.18(TD+)
SFI_TX3_N: P2.19(TD-)
SFI_TX3_P: P2.18(TD+)
NetC82_2: C82.2 C83.2 L7.1 P5.15(VccR) P5.16(VccT)
NetC85_2: C85.2 C123.2 L8.1 P3.15(VccR) P3.16(VccT)
NetC133_2: C133.2 C134.2 L9.1 P2.15(VccR) P2.16(VccT)
NetC136_2: C136.2 C137.2 L10.1 P4.15(VccR) P4.16(VccT)
NetDS3_2: DS3.2(A) R36.1
NetDS4_2: DS4.2(A) R37.1
NetDS5_2: DS5.2(A) R38.1
NetDS6_2: DS6.2(A) R39.1
NetP2_3: P2.3(Tx_Disable) R27.2
NetP2_7: P2.7(RS0) R23.1
NetP2_9: P2.9(RS1) R22.1
NetP3_3: P3.3(Tx_Disable) R26.2
NetP3_7: P3.7(RS0) R21.1
NetP3_9: P3.9(RS1) R20.1
NetP4_3: P4.3(Tx_Disable) R34.2
NetP4_7: P4.7(RS0) R29.1
NetP4_9: P4.9(RS1) R28.1
NetP5_3: P5.3(Tx_Disable) R35.2
NetP5_7: P5.7(RS0) R31.1
NetP5_9: P5.9(RS1) R30.1

Not connected (* = marked no-connect by the designer): P2 2(Tx_Fault)*; P3 2(Tx_Fault)*; P4 2(Tx_Fault)*; P5 2(Tx_Fault)*

### Notes on the sheet
- (near R19) NOPOP
- 2009   THIS DOCUMENT IS THE PROPERTY OF THE OWNER, AND MAY NOT BE COPIED OR USED FOR ANY PURPOSE OTHER THAN THAT FOR WHICH IT IS SUPPLIED WITHOUT PERMISSION IN WRITING FROM THE OWNER.
- C
- DATESTAMP OF THIS PRINT
- DRAWN BY:
- DOCUMENT NUMBER:
- SCHEMATIC FILENAME:
- PCB FILENAME:
- ENGINEER:
- APPROVED:
- CIRCUIT DIAGRAM
- DATE
- SHEET
- REVISION
- OF

### Library data of the parts
C82 C85 C133 C136 = CAP-CER-1: as C35 on sheet mezzanine; POD number: CAP-CER-1; Value: 0.1uF; RoHS: Y; Sort Value: 0.1; Category: Capacitors; Subcategory: Ceramic
C83 C84 C123 C132 C134 C135 C137 C138 = CAP-CER-3: as C45 on sheet phy0; POD number: CAP-CER-3; Value: 4.7uF; RoHS: Y; Sort Value: 4.7; Category: Capacitors; Subcategory: Ceramic
DS1 DS2 = OPTO-LPIPE-1: 2-High, press-fit, 3mm round, light-pipe; Manufacturer: Dialight; Colour: NA; POD number: OPTO-LPIPE-1; PartNum: 515-1094F; RoHS: Y; Vdrop: NA; Rating: NA; Category: OPTO; Subcategory: LPIPE
DS3-DS6 = OPTO-LED-0: Green, Surface mount, LED, 1206; Manufacturer: LUMEX; Vdrop: 2.2V; Rating: 20mA; POD number: OPTO-LED-0; PartNum: SML-LX1206GC-TR; RoHS: Y; Category: OPTO; Subcategory: LED
L7-L10 = IND-FB-1: as L1 on sheet phy0; POD number: IND-FB-1; RoHS: Y; Value: 120R; Sort Value: 120; Category: Inductors; Subcategory: FerriteBead
P1 = CONN-PCB-26: SFP+ 1X4 Cage Assembly; Manufacturer: Molex; POD number: CONN-PCB-26; PartNum: 0747540420; RoHS: Y; Category: CONN; Subcategory: PCB
P2-P5 = CONN-PCB-27: 20 Circuit, 0.8mm pitch SFP+ host connector; Manufacturer: Molex; POD number: CONN-PCB-27; PartNum: 74441-0001; RoHS: Y; Category: CONN; Subcategory: PCB
R19 = RES-TF-0: as R65 on sheet phy1; POD number: RES-TF-0; Value: 0R; Sort Value: 0; Category: Resistors; Subcategory: ThickFilm; HelpURL: http://www.royalohm.com/pdf/general.pdf
R20-R35 R41-R43 R47-R51 = RES-TF-7: as R7 on sheet mezzanine; POD number: RES-TF-7; Value: 3K3; Sort Value: 3300; Category: Resistors; Subcategory: ThickFilm; HelpURL: http://www.royalohm.com/pdf/general.pdf
R36-R39 = RES-TF-19: 200R, 1.1mm x 0.5mm, Thick Film Resistor; Manufacturer: ROYALOHM; PartNum: 0402WGF0201T1E; Tolerance: 1%; Rating: 0.0625W; POD number: RES-TF-19; Value: 200R; Sort Value: 200; Category: Resistors; Subcategory: ThickFilm; HelpURL: http://www.royalohm.com/pdf/general.pdf